# EasyEDA Pro project WEN-多通道电源模块mmk.epro, schematic Schematic7

## Sheets
1 REF多通道: Board Name: WEN-多通道电源模块; Create Date: 2025-05-08; Page Name: REF多通道; Project Name: 【电赛模块】2025电赛预制模块mmkk; Schematic Name: Schematic7; Update Date: 2025-05-09; Company: 嘉立创EDA; Page Size: A1; Version: V1.0
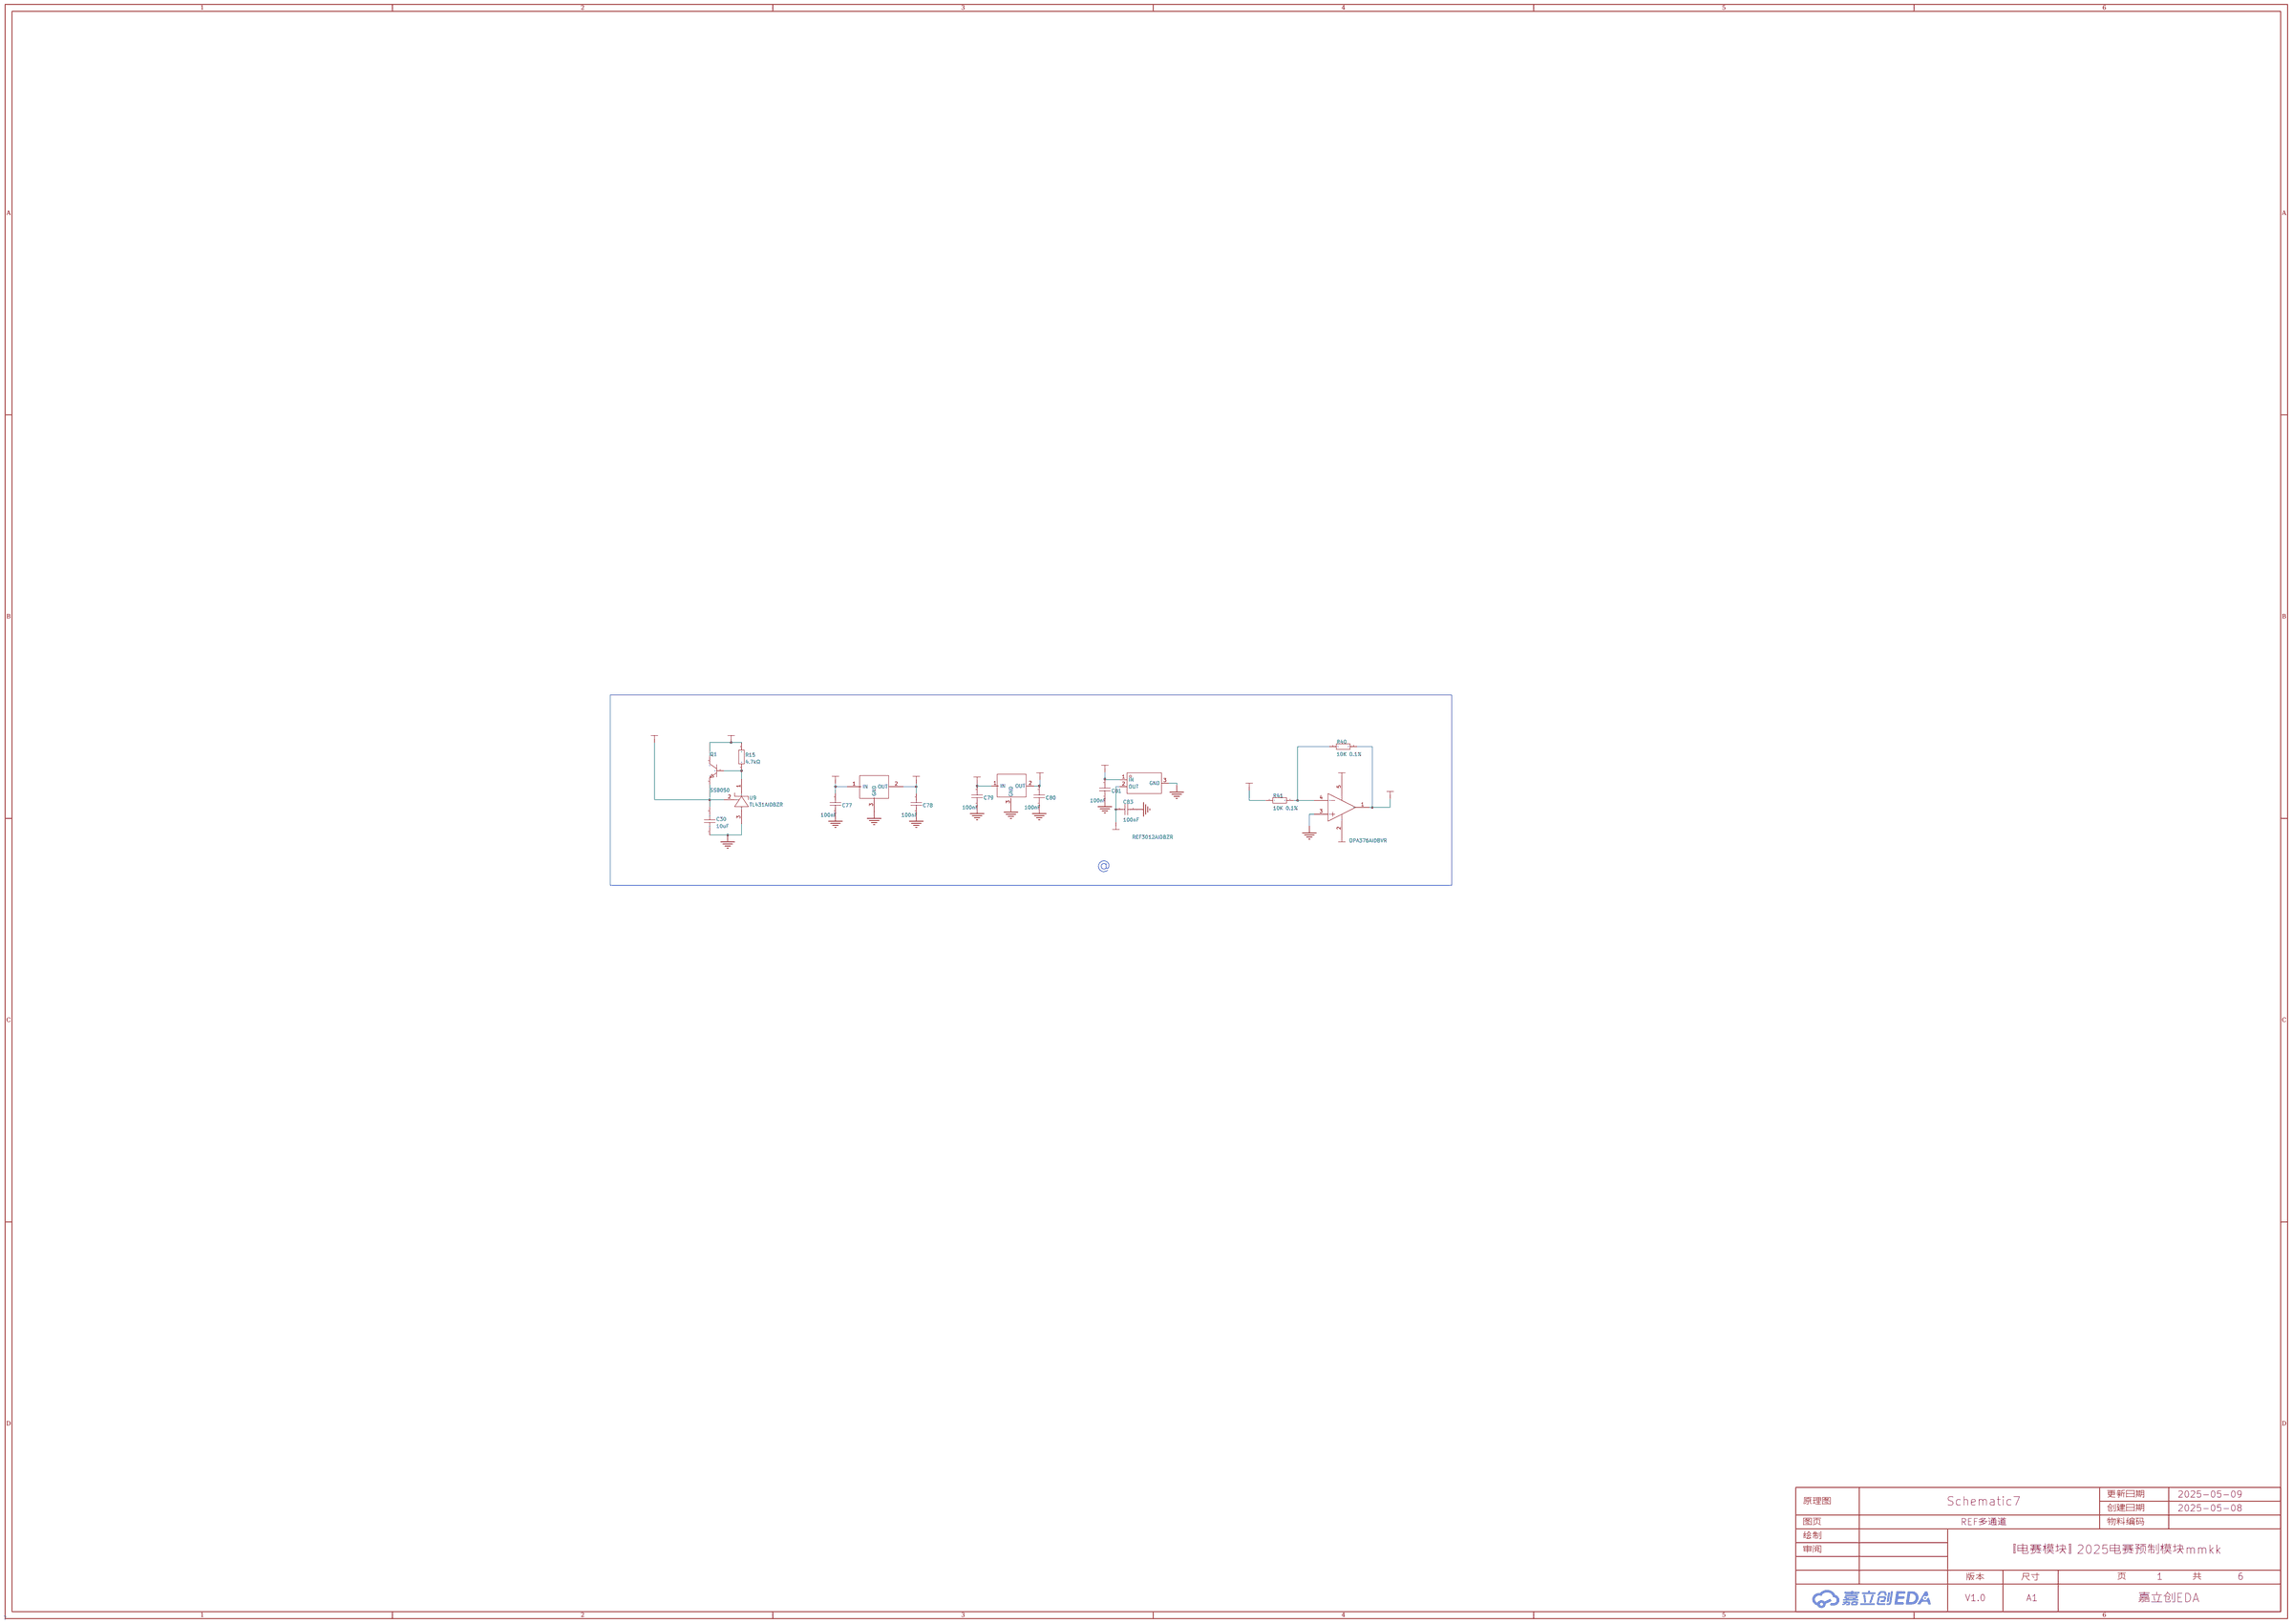
[diagram p0: REF多通道]
2 LDO可调317: Page Name: LDO可调317; Page Size: A4
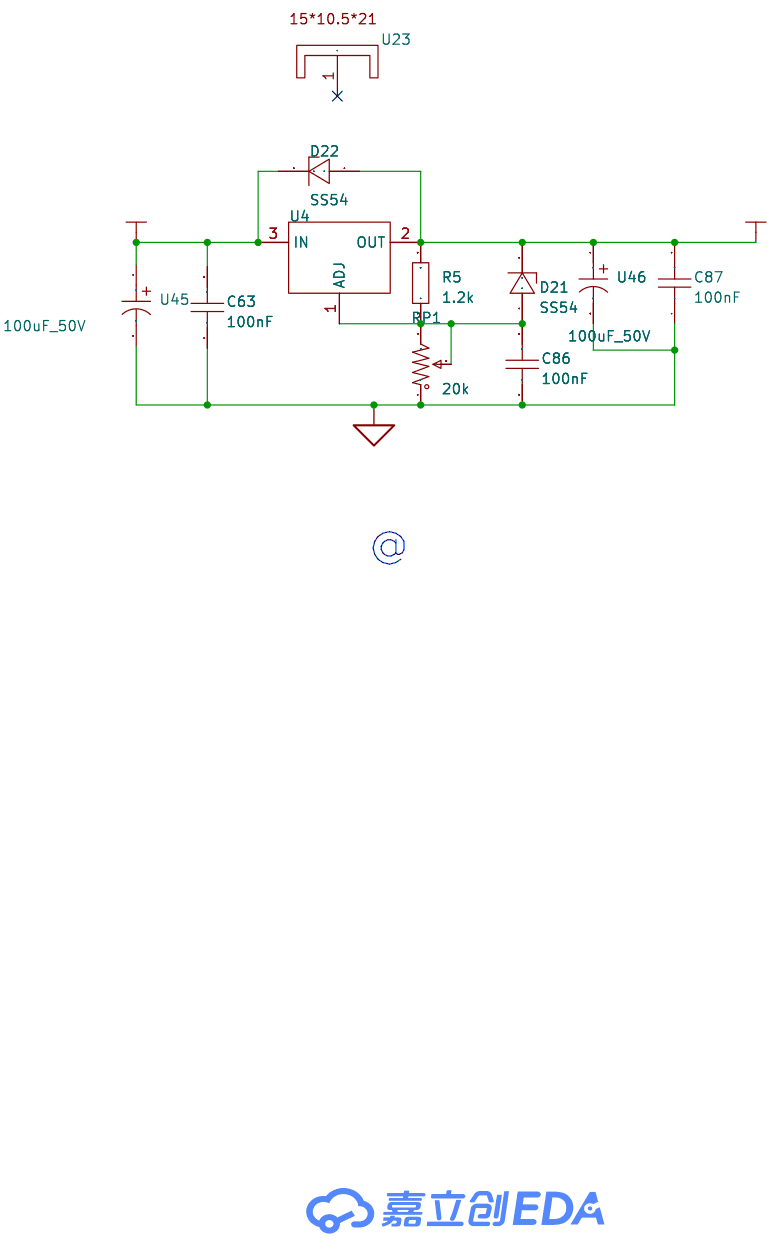
[diagram p1: LDO可调317]
3 DCDC输出: Page Name: DCDC输出; Update Date: 2025-05-10; Page Size: A3
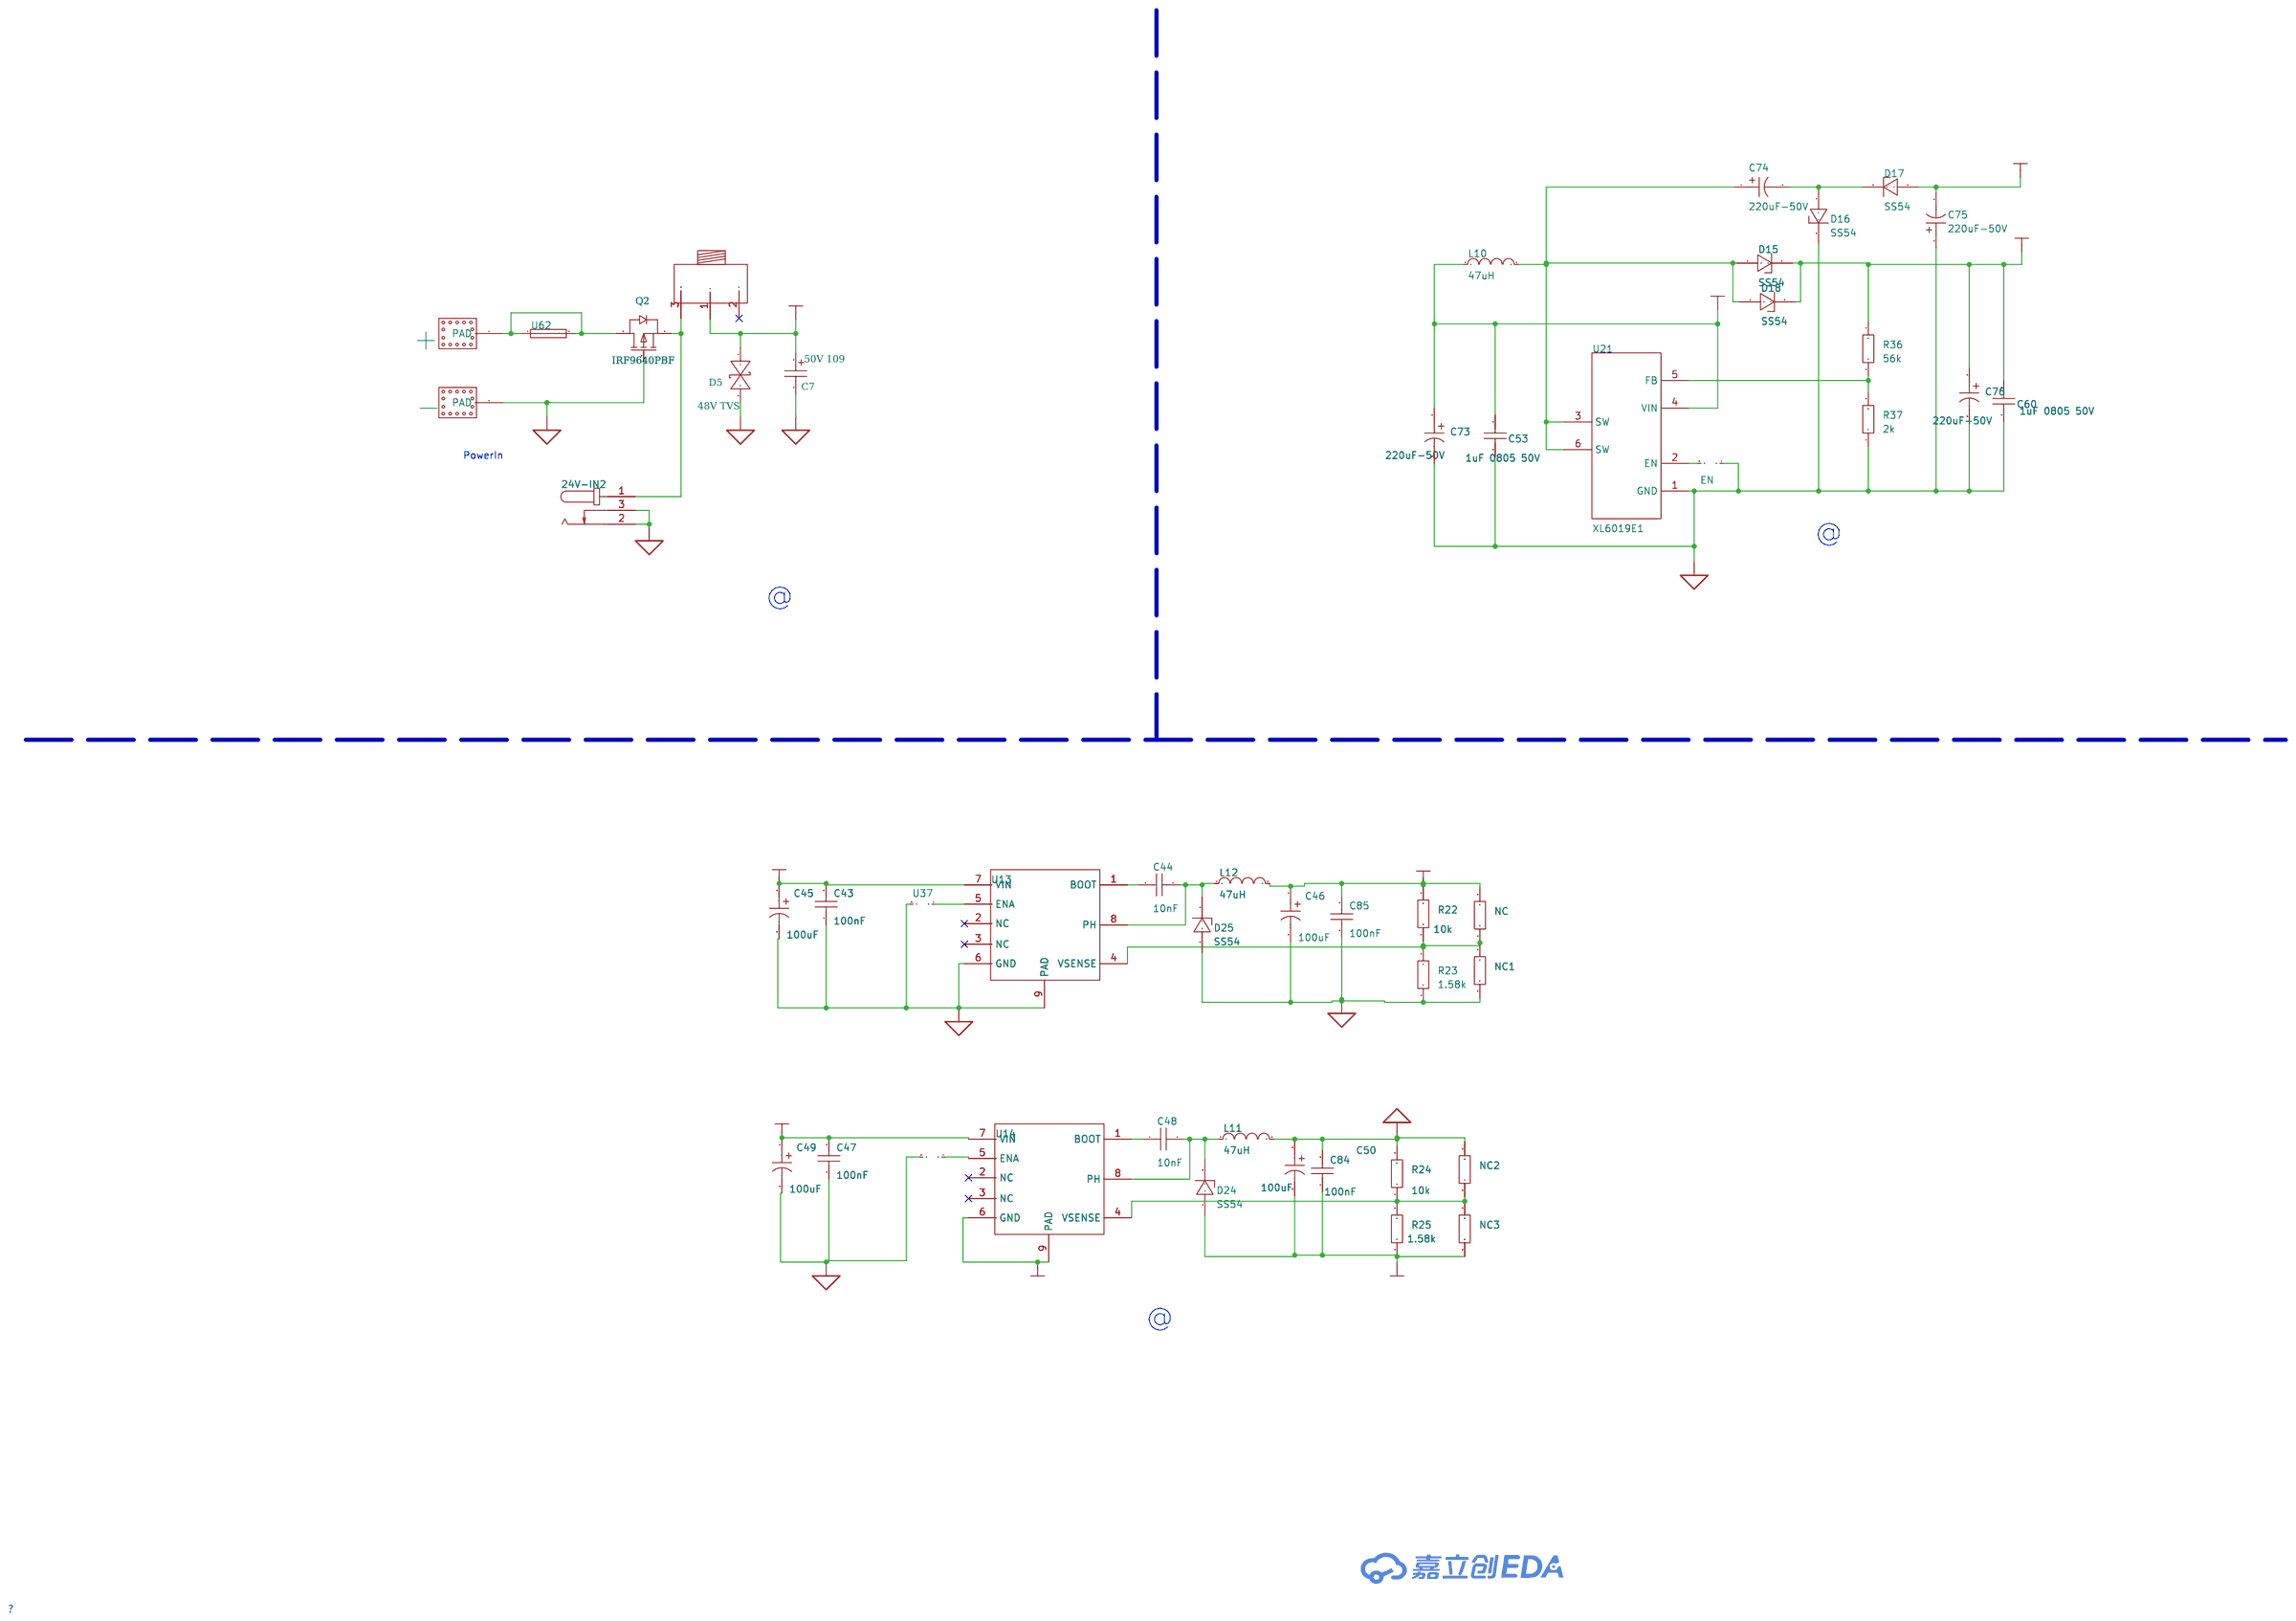
[diagram p2: DCDC输出]
4 LDO输出: Page Name: LDO输出
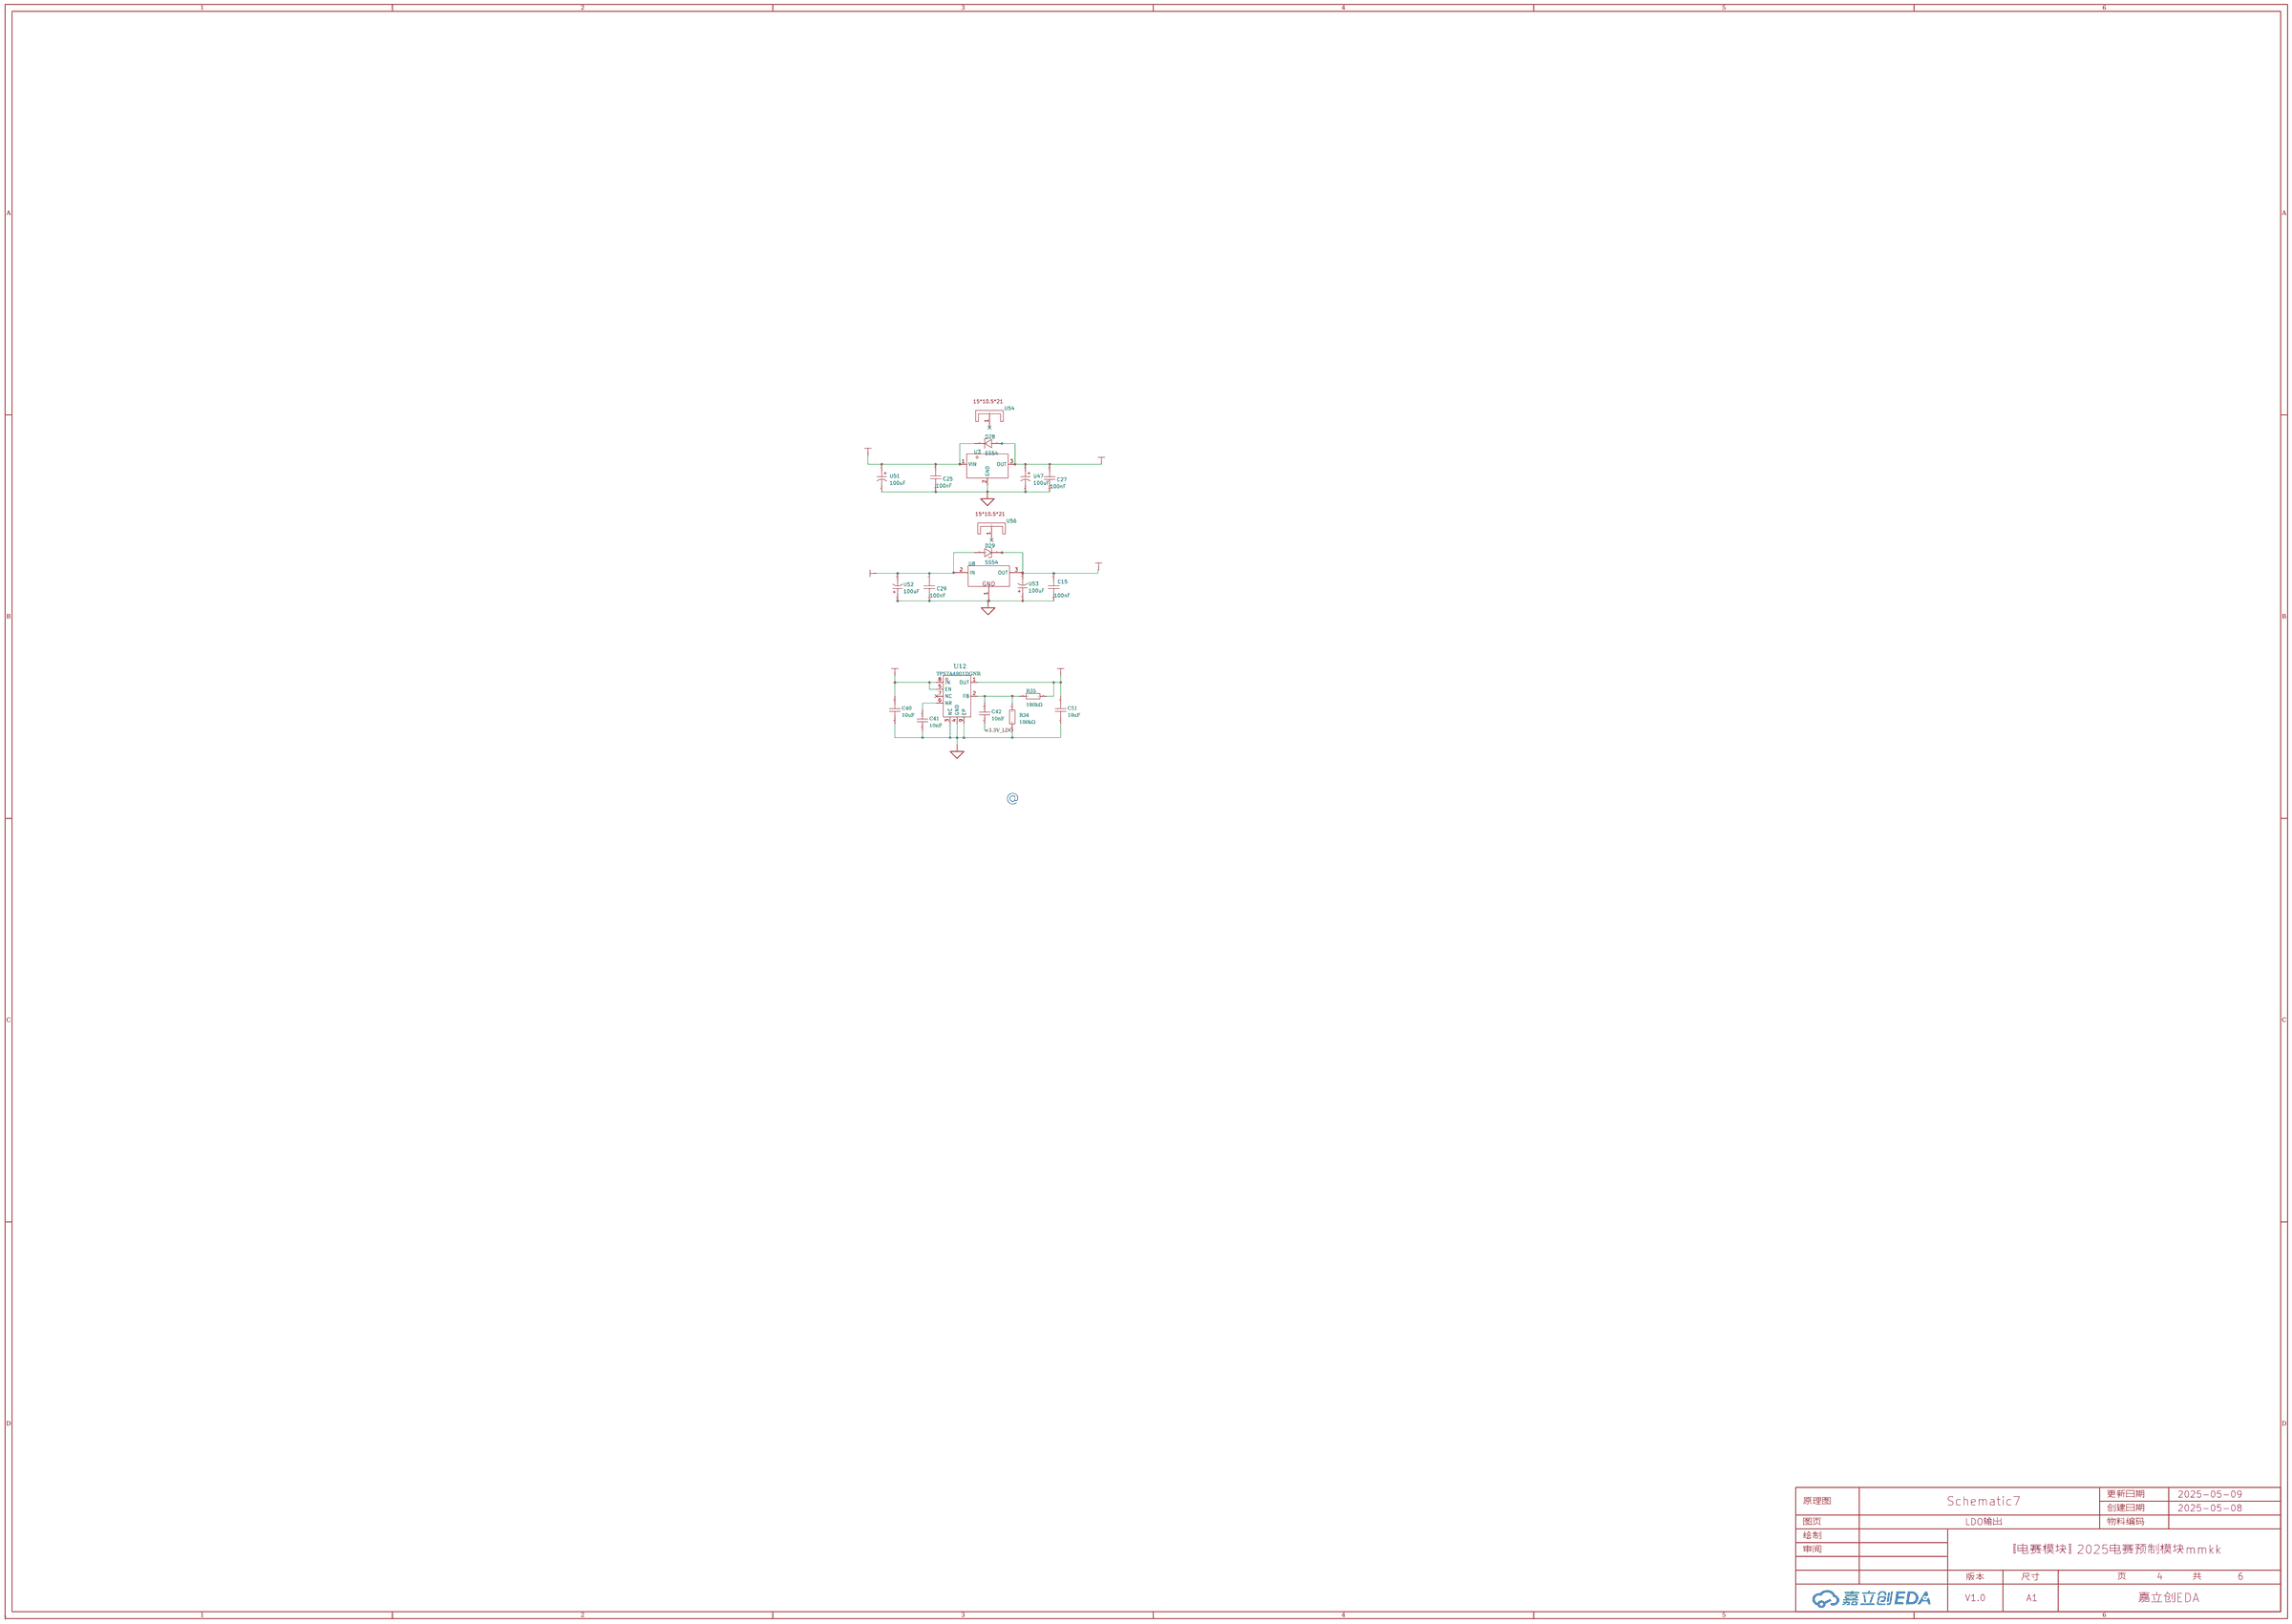
[diagram p3: LDO输出]
5 接口: Create Date: 2025-05-09; Page Name: 接口; Update Date: 2025-05-10
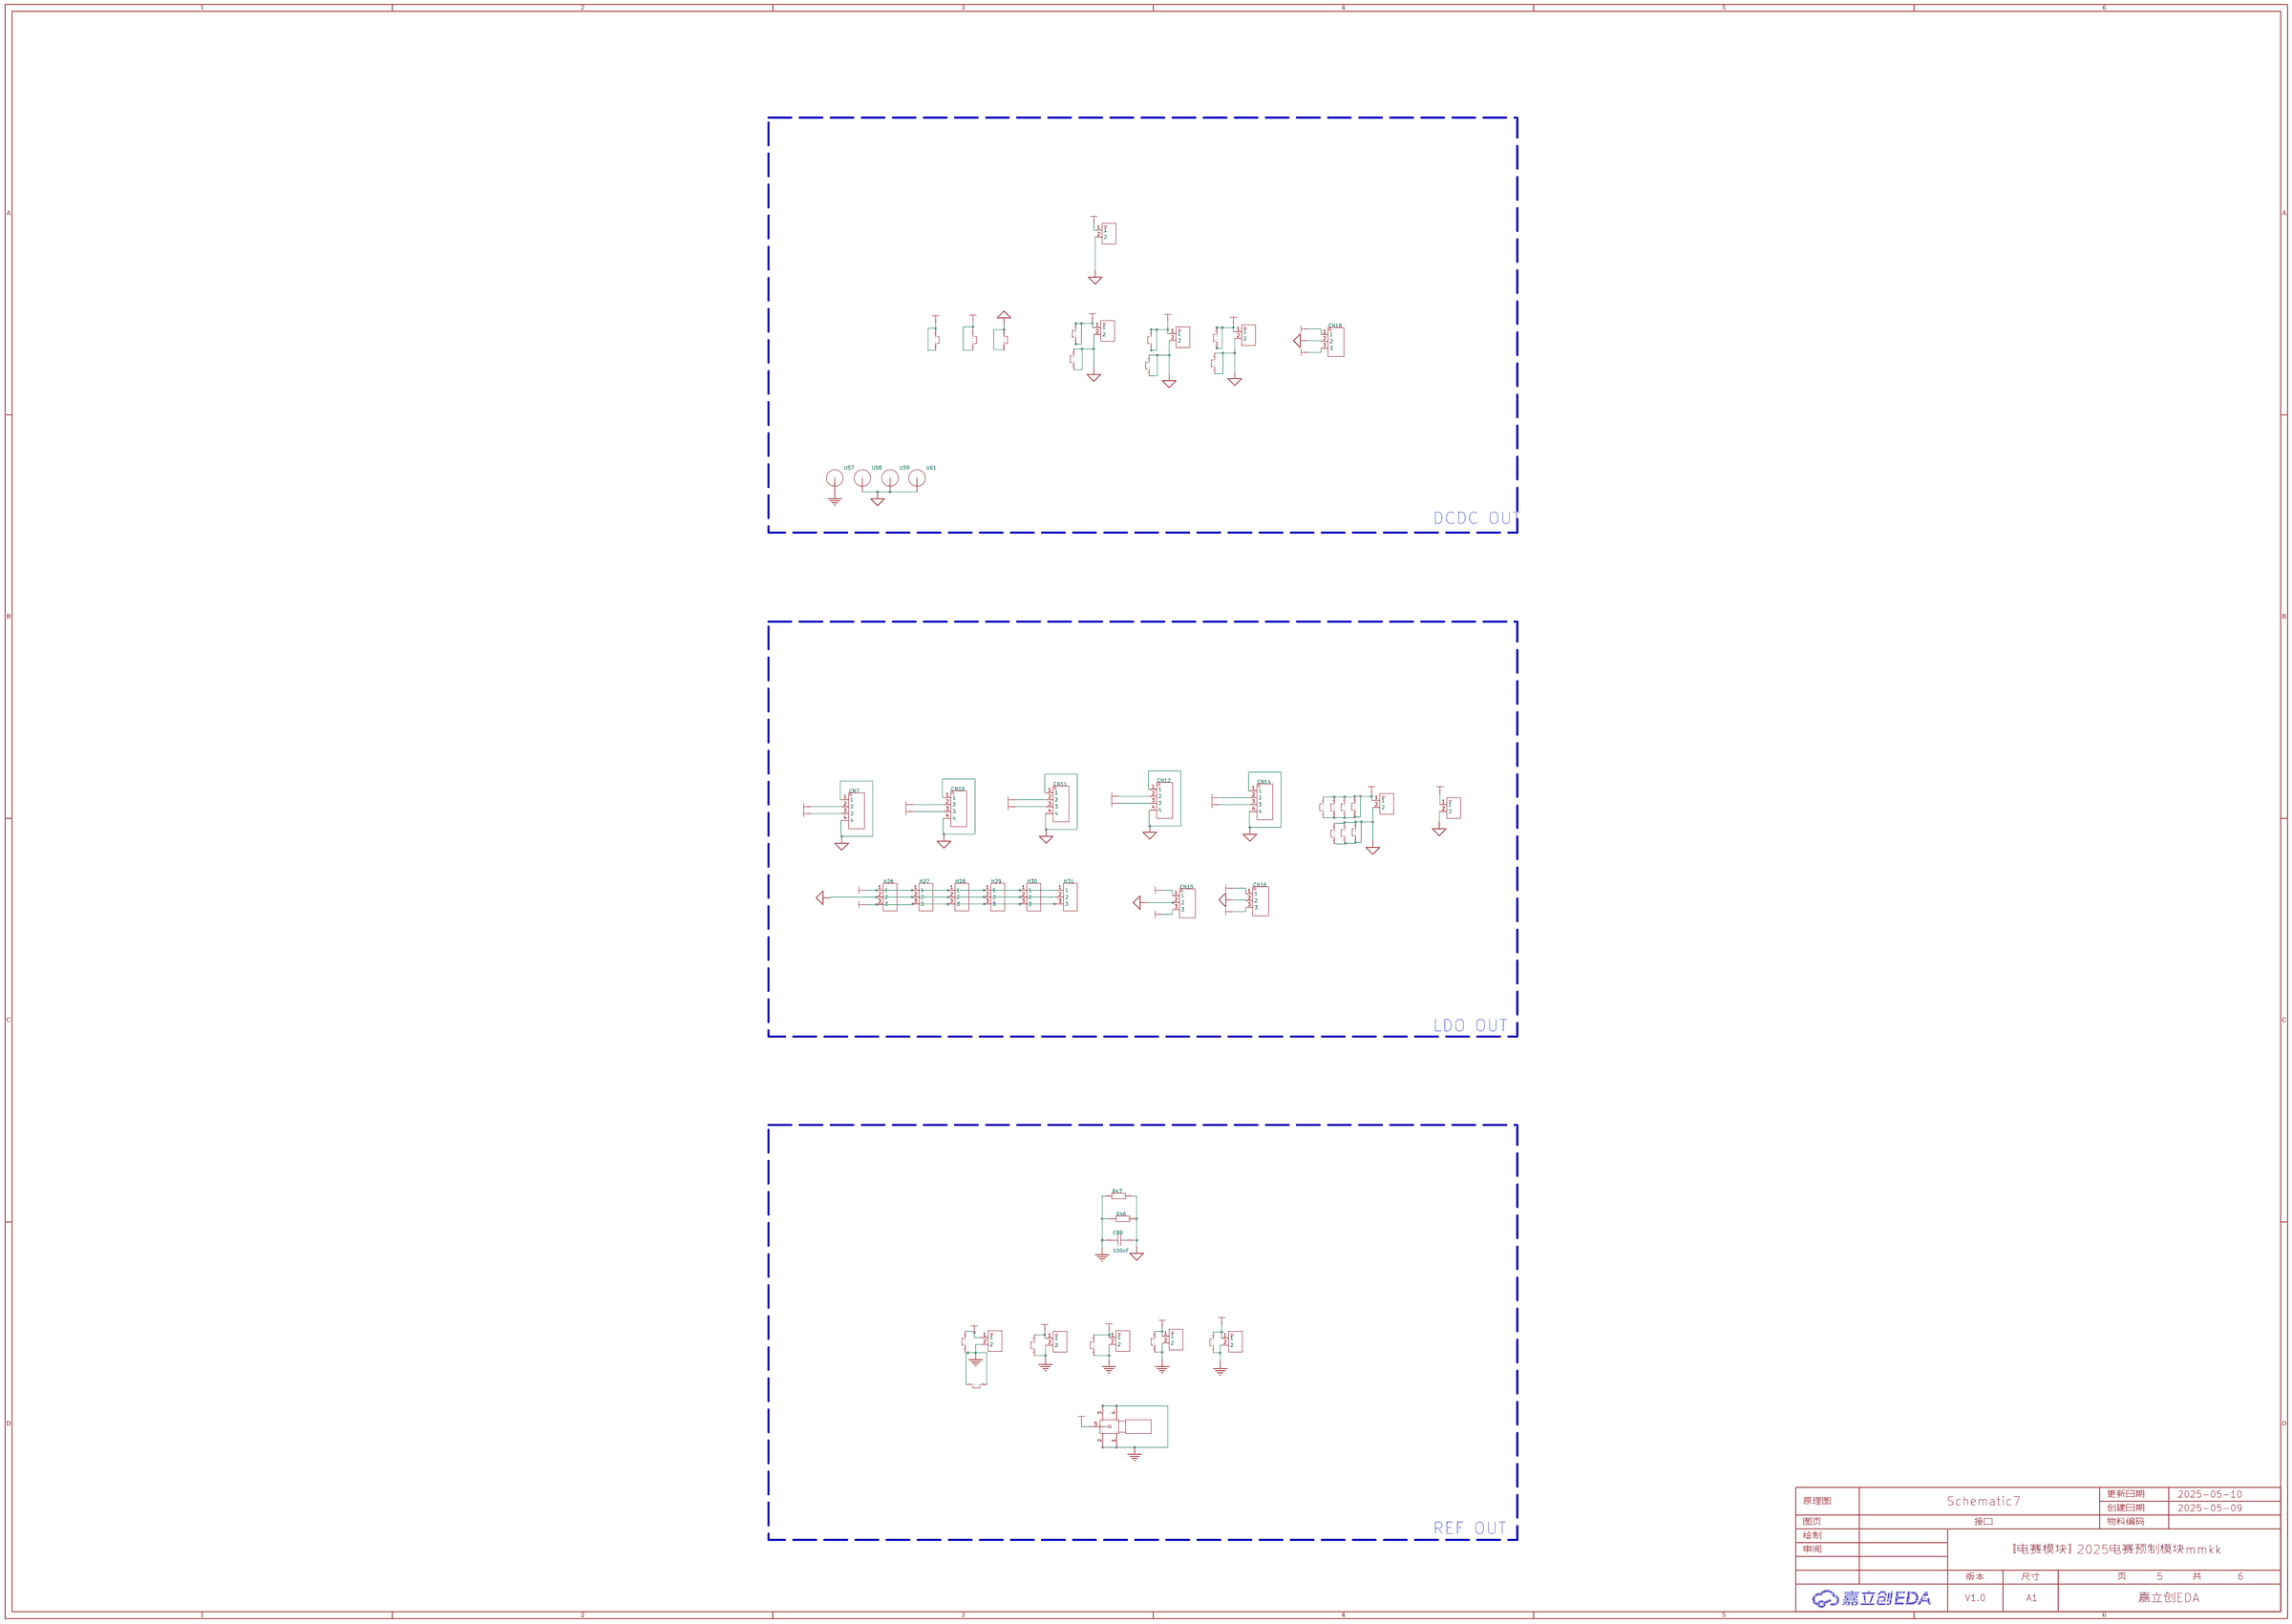
[diagram p4: 接口]
6 指示灯: Create Date: 2025-05-09; Page Name: 指示灯
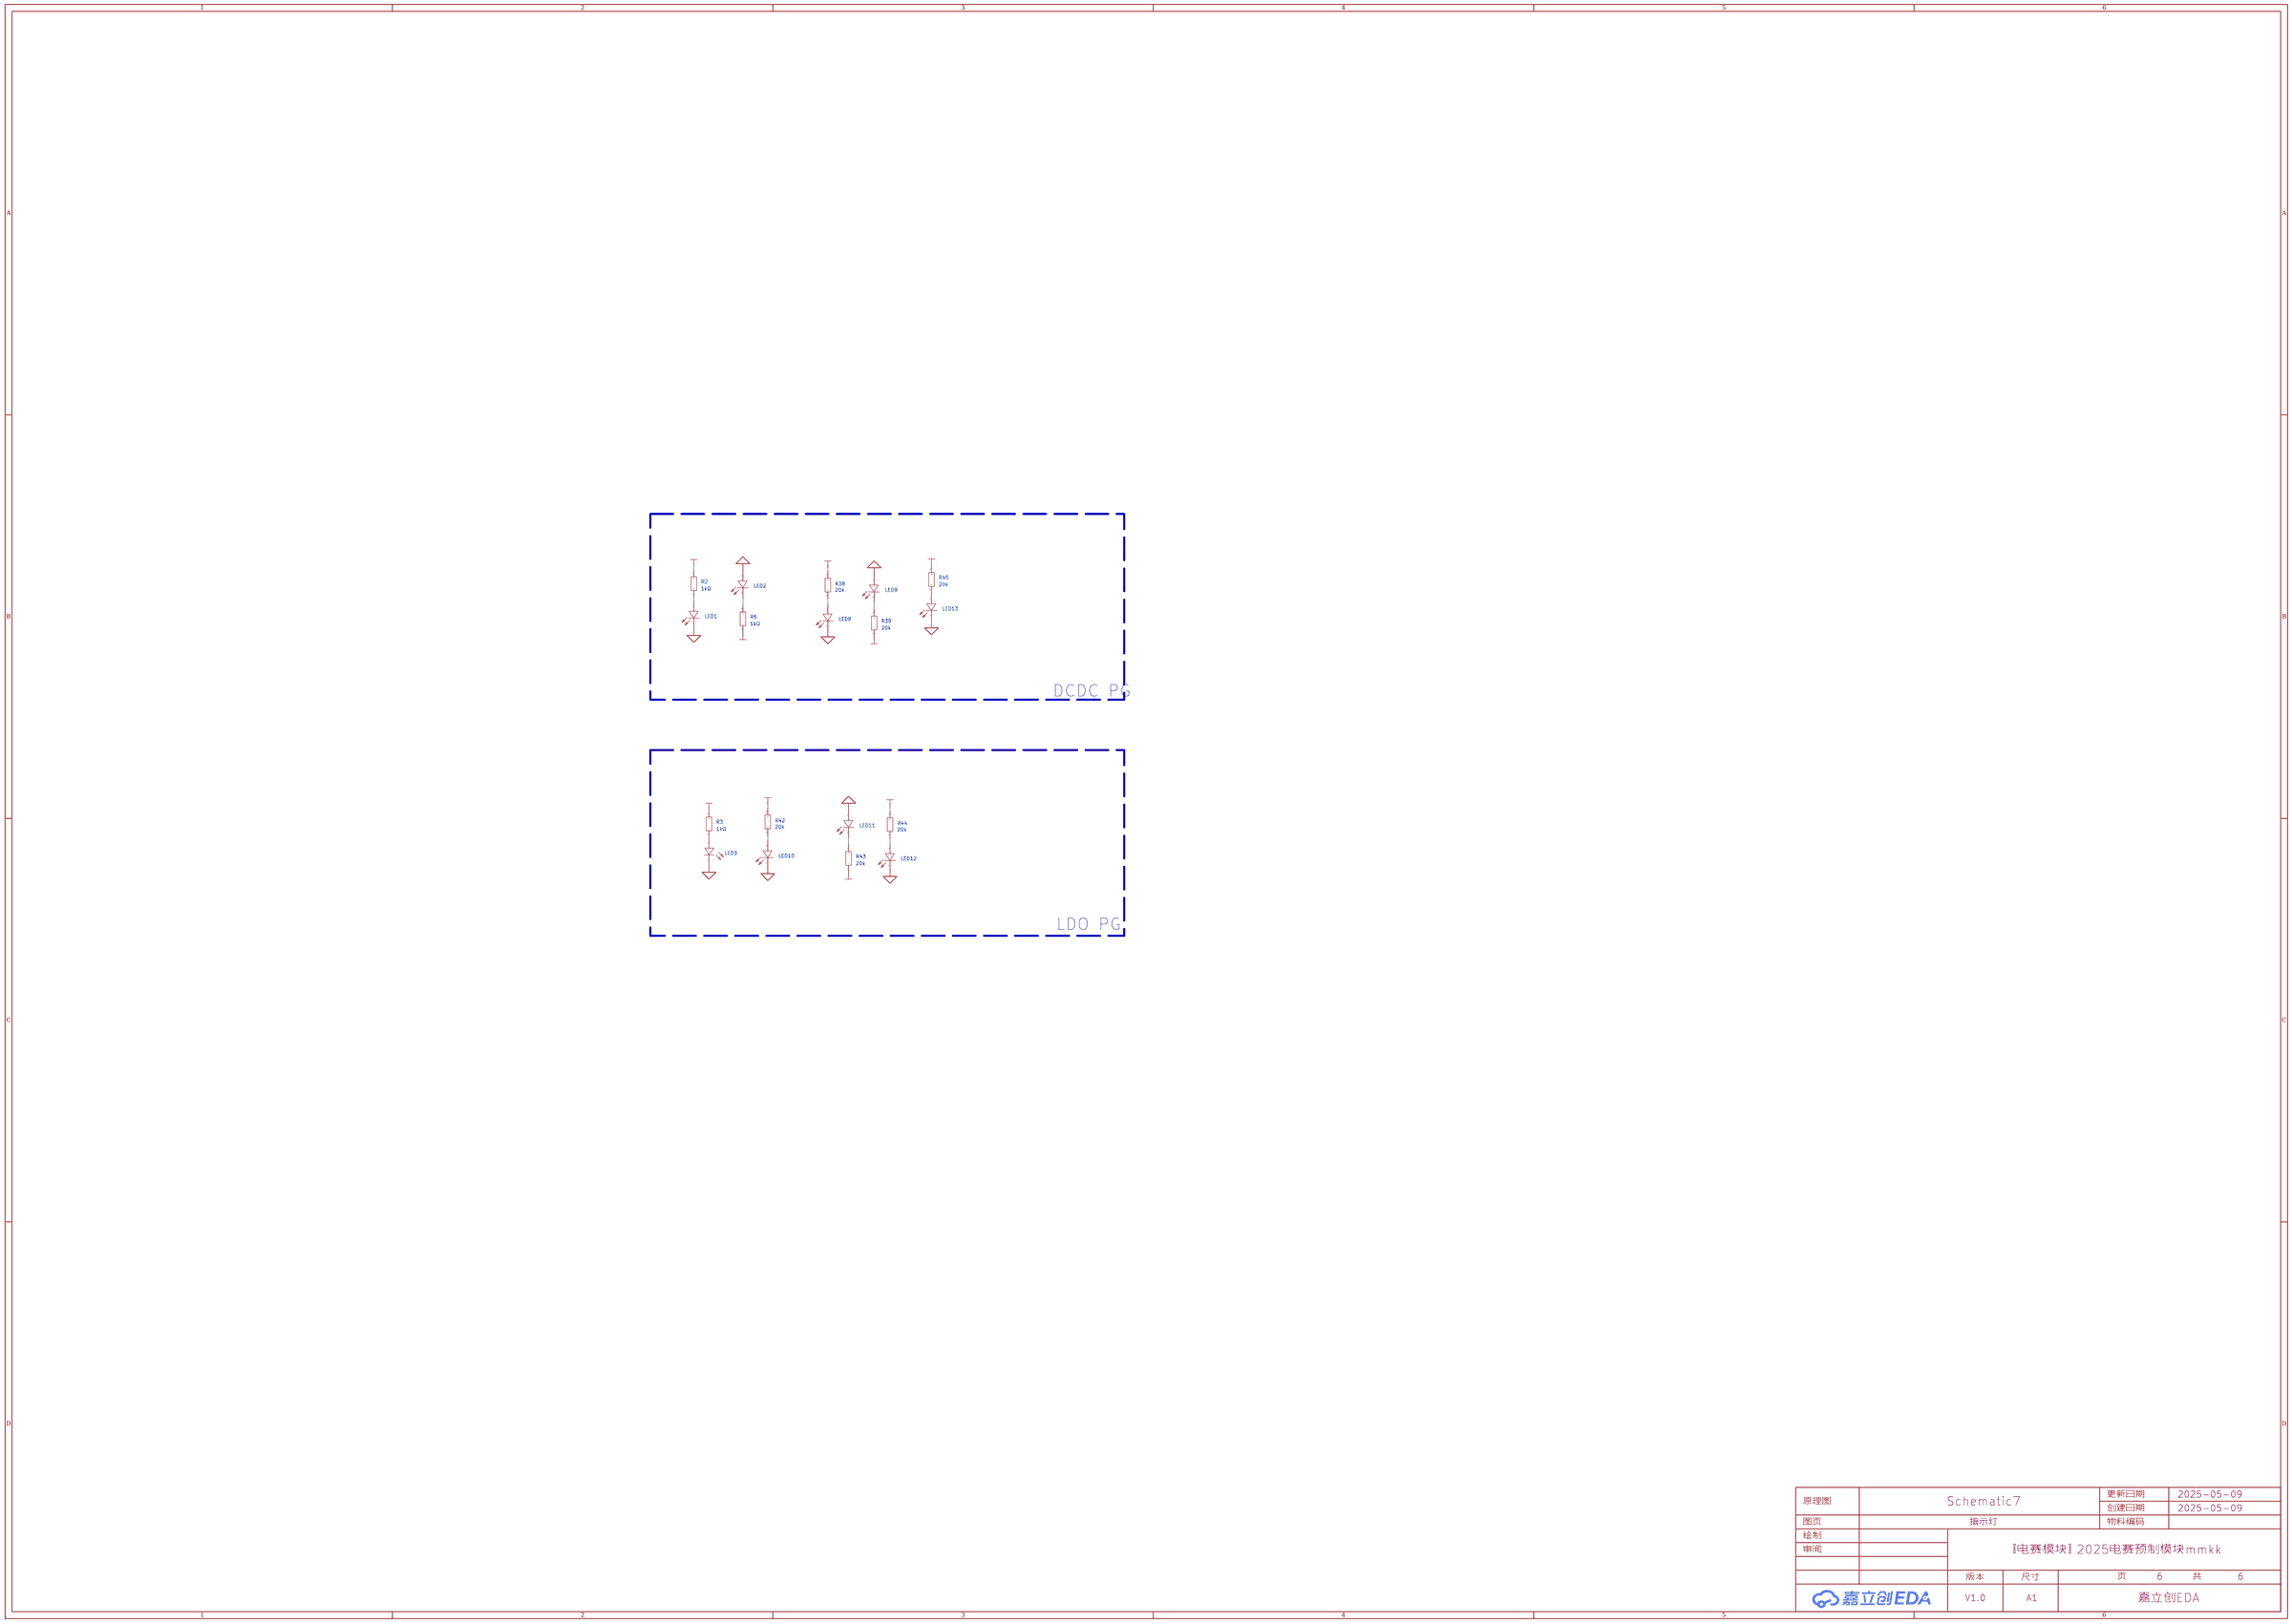
[diagram p5: 指示灯]

## Parts
sheet DCDC输出
24V-IN2  DC-005-20A  [DC-IN-TH_DC-005-20A]
+  -  [外界焊盘R双面-M]
-  -  [外界焊盘R双面-M]
C7  50V 109  [63V10000UF]  (no BOM)
C43  100nF  [C0805]
C44  10nF  [C0805]
C45  100uF  [CAP-SMD_BD6.3-L6.6-W6.6-LS7.6-FD-1]
C46  100uF  [CAP-SMD_BD6.3-L6.6-W6.6-LS7.6-FD-1]
C47  100nF  [C0805]
C48  10nF  [C0805]
C49  100uF  [CAP-SMD_BD6.3-L6.6-W6.6-LS7.6-FD-1]
C50  100uF  [CAP-SMD_BD6.3-L6.6-W6.6-LS7.6-FD-1]
C53  1uF 0805 50V  [C0805]
C60  1uF 0805 50V  [C0805]
C73  220uF-50V  [CAP-SMD_BD8.0-L8.3-W8.3-LS9.1-FD]
C74  220uF-50V  [CAP-SMD_BD8.0-L8.3-W8.3-LS9.1-FD]
C75  220uF-50V  [CAP-SMD_BD8.0-L8.3-W8.3-LS9.1-FD]
C76  220uF-50V  [CAP-SMD_BD8.0-L8.3-W8.3-LS9.1-FD]
C84  100nF  [C0805]
C85  100nF  [C0805]
D5  48V TVS  [DO-214AA_L4.4-W3.6-LS5.3-BI]
D15  SS54  [SMA_L4.3-W2.6-LS5.0-FD]
D16  SS54  [SMA_L4.3-W2.6-LS5.0-FD]
D17  SS54  [SMA_L4.3-W2.6-LS5.0-FD]
D18  SS54  [SMA_L4.3-W2.6-LS5.0-FD]
D24  SS54  [SMA_L4.3-W2.6-LS5.0-FD]
D25  SS54  [SMA_L4.3-W2.6-LS5.0-FD]
L10  47uH  [IND-SMD_L10.8-W10.0_SLO1040H]
L11  47uH  [IND-SMD_L10.8-W10.0_SLO1040H]
L12  47uH  [IND-SMD_L10.8-W10.0_SLO1040H]
NC  10k  [R0805]
NC1  10k  [R0805]
NC2  10k  [R0805]
NC3  10k  [R0805]
Q2  IRF9640PBF  [TO-220-3_L10.0-W4.5-P2.54-L]
R22  10k  [R0805]
R23  1.58k  [R0805]
R24  10k  [R0805]
R25  1.58k  [R0805]
R36  56k  [R0805]
R37  2k  [R0805]
SW3  -  [钮子开关]
U13  TPS5430DDAR  [ESOP-8_L4.9-W3.9-P1.27-LS6.0-TL-EP]
U14  TPS5430DDAR  [ESOP-8_L4.9-W3.9-P1.27-LS6.0-TL-EP]
U21  XL6019E1  [TO-263-5_L10.2-W9.9-P1.70-LS14.4-TL]
U22  EN  [短接调试焊盘]
U37  -  [短接调试焊盘]
U38  -  [短接调试焊盘]
U62  BSMD0805-050-12V  [F0805]  (no BOM)
sheet LDO可调317
C63  100nF  [C0805]
C86  100nF  [C0805]
C87  100nF  [C0805]
D21  SS54  [SMA_L4.3-W2.6-LS5.0-FD]
D22  SS54  [SMA_L4.3-W2.6-LS5.0-FD]
R5  1.2k  [R0805]
RP1  20k  [RES-ADJ-TH_3P-L9.5-W4.85-P2.50-BL-BS]
U4  LM317  [TO-220-3_L10.0-W4.5-P2.54-L]
U23  -  [散热片25*15*10]
U45  100uF_50V  [CAP-SMD_BD6.3-L6.6-W6.6-LS7.2-FD]
U46  100uF_50V  [CAP-SMD_BD6.3-L6.6-W6.6-LS7.2-FD]
sheet LDO输出
C15  100nF  [C0805]
C25  100nF  [C0805]
C27  100nF  [C0805]
C29  100nF  [C0805]
C40  10uF  [C0805]
C41  10nF  [C0805]
C42  10nF  [C0805]
C51  10uF  [C0805]
D28  SS54  [SMA_L4.3-W2.6-LS5.0-FD]
D29  SS54  [SMA_L4.3-W2.6-LS5.0-FD]
R34  100kΩ  [R0805]
R35  180kΩ  [R0805]
U3  LM7805CT  [TO-220-3_L10.0-W4.5-P2.54-L]
U8  LM7905CT/NOPB  [TO-220-3_L10.0-W4.5-P2.54-L]
U12  TPS7A4901DGNR  [MSOP-8_L3.0-W3.0-P0.65-LS5.0-BL-EP]
U47  100uF  [CAP-SMD_BD6.3-L6.6-W6.6-LS7.2-FD]
U51  100uF  [CAP-SMD_BD6.3-L6.6-W6.6-LS7.2-FD]
U52  100uF  [CAP-SMD_BD6.3-L6.6-W6.6-LS7.2-FD]
U53  100uF  [CAP-SMD_BD6.3-L6.6-W6.6-LS7.2-FD]
U54  -  [散热片25*15*10]
U56  -  [散热片25*15*10]
sheet REF多通道
C30  10uF  [C0805]
C77  100nF  [C0805]
C78  100nF  [C0805]
C79  100nF  [C0805]
C80  100nF  [C0805]
C81  100nF  [C0805]
C83  100nF  [C0805]
Q1  SS8050  [SOT-23-3_L2.9-W1.3-P1.90-LS2.4-BR]
R15  4.7kΩ  [R0805]
R40  10K 0.1%  [R0805]
R41  10K 0.1%  [R0805]
U9  TL431AIDBZR  [SOT-23-3_L2.9-W1.6-P1.90-LS2.8-BR]
U25  -  [SOT-23-3_L2.9-W1.6-P1.90-LS2.8-BR]
U26  -  [SOT-23-3_L3.0-W1.7-P0.95-LS2.9-BR]
U27  REF3012AIDBZR  [SOT-23-3_L2.9-W1.3-P1.90-LS2.4-BR]
U28  OPA376AIDBVR  [SOT-23-5_L3.0-W1.7-P0.95-LS2.8-BR]
sheet 指示灯
LED1  NCD0805R1  [LED0603-RD_RED]
LED2  NCD0805R1  [LED0603-RD_RED]
LED3  -  [LED0603-RD_RED]
LED8  NCD0805R1  [LED0603-RD_RED]
LED9  NCD0805R1  [LED0603-RD_RED]
LED10  NCD0805R1  [LED0603-RD_RED]
LED11  NCD0805R1  [LED0603-RD_RED]
LED12  NCD0805R1  [LED0603-RD_RED]
LED13  NCD0805R1  [LED0603-RD_RED]
R2  1kΩ  [R0805]
R3  1kΩ  [R0805]
R6  1kΩ  [R0805]
R38  20k  [R0805]
R39  20k  [R0805]
R42  20k  [R0805]
R43  20k  [R0805]
R44  20k  [R0805]
R45  20k  [R0805]
sheet 接口
C88  100nF  [C0603]
CN7  WJ15EDGVC-3.81-4P  [CONN-TH_4P-P3.81_WJ2EDGVC-3.81-4P]
CN10  WJ15EDGVC-3.81-4P  [CONN-TH_4P-P3.81_WJ2EDGVC-3.81-4P]
CN11  WJ15EDGVC-3.81-4P  [CONN-TH_4P-P3.81_WJ2EDGVC-3.81-4P]
CN12  WJ15EDGVC-3.81-4P  [CONN-TH_4P-P3.81_WJ2EDGVC-3.81-4P]
CN14  WJ15EDGVC-3.81-4P  [CONN-TH_4P-P3.81_WJ2EDGVC-3.81-4P]
CN15  WJ15EDGVC-3.81-3P  [CONN-TH_3P-P3.81_WJ15EDGVC-3.81-3P]
CN16  WJ15EDGVC-3.81-3P  [CONN-TH_3P-P3.81_WJ15EDGVC-3.81-3P]
CN18  WJ15EDGVC-3.81-3P  [CONN-TH_3P-P3.81_WJ15EDGVC-3.81-3P]
H1  PZ254V-11-02P  [HDR-TH_2P-P2.54-V-M]
H2  PZ254V-11-02P  [HDR-TH_2P-P2.54-V-M]
H3  PZ254V-11-02P  [HDR-TH_2P-P2.54-V-M]
H4  PZ254V-11-02P  [HDR-TH_2P-P2.54-V-M]
H5  PZ254V-11-02P  [HDR-TH_2P-P2.54-V-M]
H7  PZ254V-11-02P  [HDR-TH_2P-P2.54-V-M]
H8  PZ254V-11-02P  [HDR-TH_2P-P2.54-V-M]
H9  PZ254V-11-02P  [HDR-TH_2P-P2.54-V-M]
H10  PZ254V-11-02P  [HDR-TH_2P-P2.54-V-M]
H15  PZ254V-11-02P  [HDR-TH_2P-P2.54-V-M]
H16  PZ254V-11-02P  [HDR-TH_2P-P2.54-V-M]
H19  PZ254V-11-02P  [HDR-TH_2P-P2.54-V-M]
H20  PZ254V-11-02P  [HDR-TH_2P-P2.54-V-M]
H21  PZ254V-11-02P  [HDR-TH_2P-P2.54-V-M]
H22  PZ254V-11-02P  [HDR-TH_2P-P2.54-V-M]
H23  PZ254V-11-02P  [HDR-TH_2P-P2.54-V-M]
H24  PZ254V-11-02P  [HDR-TH_2P-P2.54-V-M]
H25  PZ254V-11-02P  [HDR-TH_2P-P2.54-V-M]
H26  PZ254V-11-03P  [HDR-TH_3P-P2.54-V-M]
H27  PZ254V-11-03P  [HDR-TH_3P-P2.54-V-M]
H28  PZ254V-11-03P  [HDR-TH_3P-P2.54-V-M]
H29  PZ254V-11-03P  [HDR-TH_3P-P2.54-V-M]
H30  PZ254V-11-03P  [HDR-TH_3P-P2.54-V-M]
H31  PZ254V-11-03P  [HDR-TH_3P-P2.54-V-M]
H32  PZ254V-11-02P  [HDR-TH_2P-P2.54-V-M]
H33  PZ254V-11-02P  [HDR-TH_2P-P2.54-V-M]
H34  PZ254V-11-02P  [HDR-TH_2P-P2.54-V-M]
H35  PZ254V-11-02P  [HDR-TH_2P-P2.54-V-M]
R46  -  [R0603]
R47  -  [R0603]
RF1  BWSMA-KE-Z001  [SMA-TH_BWSMA-KE-Z001]
U24  -  [【电赛】直插拔端子-2P-3.81mm]
U29  -  [【电赛】直插拔端子-2P-3.81mm]
U30  -  [【电赛】直插拔端子-2P-3.81mm]
U31  -  [【电赛】直插拔端子-2P-3.81mm]
U32  -  [【电赛】直插拔端子-2P-3.81mm]
U34  -  [【电赛】直插拔端子-2P-3.81mm]
U36  -  [【电赛】直插拔端子-2P-3.81mm]
U41  -  [【电赛】直插拔端子-2P-3.81mm]
U43  -  [【电赛】直插拔端子-2P-3.81mm]
U44  -  [【电赛】直插拔端子-2P-3.81mm]
U57  -  [My_M3螺丝孔]
U58  -  [My_M3螺丝孔]
U59  -  [My_M3螺丝孔]
U61  -  [My_M3螺丝孔]
U64  -  [【电赛】直插拔端子-2P-3.81mm]

## Library data of the parts
24V-IN2 = DC-005-20A_C136744: 连接器类型:DC电源插座;安装方式:弯插;触点内径:2mm;触点外径:6.4mm;额定电流:500mA;额定电压:30V;工作温度范围:-25℃~+80℃;; LCSC Part Name: DC电源插座 内径:2mm 外径:6.4mm; Supplier Part: C136744; Manufacturer: 韩国韩荣; Supplier Footprint: 插件; JLCPCB Part Class: 扩展库; Datasheet: https://atta.szlcsc.com/upload/public/pdf/source/20210810/D1FE451D887B1804F0660F580C4AD849.pdf; Supplier: LCSC; Connector Type: DC电源插座; Mounting Style: 弯插; Inside Contact Diameter: 2mm; Outside Contact Diameter: 6.4mm; Current Rating (Max): 500mA; Voltage Rating (Max): 30V; Operating Temperature Range: -25℃~+80℃
+ = 外接焊盘R双面-M
- = 外接焊盘R双面-M: Check: true
C7 = 10000uF 50V: Nichicon FW Gold Aluminum Electrolytic Capacitor
C43 C47 C84 C85 = 0805B104K500NT: 容值:100nF;精度:±10%;额定电压:50V;材质(温度系数):X7R;; LCSC Part Name: 100nF ±10% 50V; Supplier Part: C38141; Manufacturer: FH(风华); Supplier Footprint: 0805; JLCPCB Part Class: Extended Part; Datasheet: https://atta.szlcsc.com/upload/public/pdf/source/20170923/C38141_1506149447419988747.pdf; Supplier: LCSC; Tolerance: ±10%; Voltage Rated: 50V; Temperature Coefficient: X7R
C44 C48 = 0805B103K500NT_C52278: 容值:10nF;精度:±10%;额定电压:50V;材质(温度系数):X7R;; LCSC Part Name: 10nF ±10% 50V; Supplier Part: C52278; Manufacturer: FH(风华); Manufacturer Part: 0805B103K500NT; Supplier Footprint: 0805; JLCPCB Part Class: Extended Part; Datasheet: https://atta.szlcsc.com/upload/public/pdf/source/20170923/C52278_1506149485247988826.pdf; Supplier: LCSC; Tolerance: ±10%; Voltage Rated: 50V; Temperature Coefficient: X7R
C45 C46 C49 C50 = RVE100UF35V67RV0072: 容值:100uF;额定电压:35V;纹波电流:-;等效串联电阻:-;; LCSC Part Name: 100uF 35V; Supplier Part: C2836437; Manufacturer: KNSCHA(科尼盛); Supplier Footprint: SMD,D6.3xL7.7mm; JLCPCB Part Class: Extended Part; Datasheet: https://atta.szlcsc.com/upload/public/pdf/source/20220719/B52EB46F8A1558448ED03D8B4CB3C24F.pdf; Supplier: LCSC; Rated Voltage: 35V
C53 C60 C77-C81 C83 = CL21B105KBFNNNE: 容值:1uF;精度:±10%;额定电压:50V;材质(温度系数):X7R;; LCSC Part Name: 1uF ±10% 50V; Supplier Part: C28323; Manufacturer: SAMSUNG(三星); Supplier Footprint: 0805; JLCPCB Part Class: 基础库; Datasheet: https://atta.szlcsc.com/upload/public/pdf/source/20160218/1457707763339.pdf; Supplier: LCSC; Tolerance: ±10%; Voltage Rated: 50V; Temperature Coefficient: X7R
C73-C76 = VP1H221M0810: 容值:220uF;精度:±20%;额定电压:50V;纹波电流:150mA;等效串联电阻:-;; LCSC Part Name: 220uF ±20% 50V; Supplier Part: C4054388; Manufacturer: HONOR(荣誉); JLCPCB Part Class: Extended Part; Datasheet: https://atta.szlcsc.com/upload/public/pdf/source/20220810/5ED31D27C84133E597BCBE81D274CAE7.pdf; Supplier: LCSC; Tolerance: ±20%; Rated Voltage: 50V; Ripple Current: 150mA; φD: 8mm; L: 10.2mm; Operating Temperature: -55℃~+105℃
D5 = SMBJ48CA-TR: 反向截止电压(Vrwm):48V;最大钳位电压:77.4V;峰值脉冲电流(Ipp)@10/1000us:8.1A;峰值脉冲功率(Ppp)@10/1000us:600W;击穿电压:53.3V;; Supplier: LCSC; Supplier Part: C672136; Manufacturer: ST(意法半导体); JLCPCB Part Class: 扩展库; LCSC Part Name: 双向TVS 48V截止; Supplier Footprint: DO-214AA; Datasheet: https://atta.szlcsc.com/upload/public/pdf/source/20211229/08FD311EEB6251CB78BA453C6CB18B67.pdf; Reverse Stand-Off Voltage (Vrwm): 48V; Maximum Clamping Voltage: 77.4V; Peak Pulse Current (Ipp)@10/1000us: 8.1A; Peak Pulse Power Dissipation (Ppp)@10/1000us: 600W; Breakdown Voltage: 53.3V; Reverse Leakage Current (Ir): 200nA; Type: TVS
D15-D18 D21 D22 D24 D25 D28 D29 = SS54_C7420369: 二极管配置:独立式;正向压降(Vf):550mV@5.0A;直流反向耐压(Vr):40V;整流电流:5A;; LCSC Part Name: 电压:40V 电流:5A; Supplier Part: C7420369; Manufacturer: 宏迦橙; Supplier Footprint: SMA(DO-214AC); JLCPCB Part Class: 扩展库; Datasheet: https://atta.szlcsc.com/upload/public/pdf/source/20230828/254C3882F8647358AD9F60DD73611B5E.pdf; Supplier: LCSC; Diode Configuration: 独立式; Forward Voltage (Vf@If): 550mV@5.0A; Reverse Voltage (Vr): 40V; Rectified Current: 5A; Reverse Leakage Current (Ir): 50uA@40V
L10-L12 = SLO1040H470MTT: 电感值:47uH;精度:±20%;额定电流:3A;; LCSC Part Name: 47uH ±20%; Supplier Part: C182153; Manufacturer: Sunltech(韩国顺磁); Supplier Footprint: SMD; JLCPCB Part Class: 扩展库; Datasheet: https://atta.szlcsc.com/upload/public/pdf/source/20201009/C207854_ACA4210DD273ACBB198904FC5A3A8806.pdf; Supplier: LCSC; Tolerance: ±20%; Rated Current: 3A; DC Resistance (DCR): 145mΩ
NC NC1-NC3 R22 R24 = 0805W8F1002T5E_C17414: 电阻类型:厚膜电阻;阻值:10kΩ;精度:±1%;功率:125mW;; LCSC Part Name: 10kΩ ±1% 125mW; Supplier Part: C17414; Manufacturer: UNI-ROYAL(厚声); Manufacturer Part: 0805W8F1002T5E; Supplier Footprint: 0805; JLCPCB Part Class: Basic Part; Datasheet: https://atta.szlcsc.com/upload/public/pdf/source/20200306/C422600_1E6D84923E4A46A82E41ADD87F860B5C.pdf; Supplier: LCSC; Type: 厚膜电阻; Tolerance: ±1%; Power(Watts): 125mW; Temperature Coefficient: ±100ppm/℃; Overload Voltage (Max): 150V; Operating Temperature Range: -55℃~+155℃
Q2 = IRF9640PBF: 类型:P沟道;漏源电压(Vdss):200V;连续漏极电流(Id):11A;功率(Pd):125W;导通电阻(RDS(on)@Vgs,Id):500mΩ@10V,6.6A;阈值电压(Vgs(th)@Id):4V@250uA;; LCSC Part Name: P沟道 耐压:200V 电流:11A; Supplier Part: C2628; Manufacturer: VISHAY(威世); Supplier Footprint: TO-220AB; JLCPCB Part Class: 扩展库; Datasheet: https://atta.szlcsc.com/upload/public/pdf/source/20160723/1469258971783.pdf; Supplier: LCSC; Type: P沟道; Drain Source Voltage (Vdss): 200V; Continuous Drain Current (Id): 11A; Power Dissipation (Pd): 125W; Drain Source On Resistance (RDS(on)@Vgs,Id): 500mΩ@10V,6.6A; Gate Threshold Voltage (Vgs(th)@Id): 4V@250uA; Total Gate Charge (Qg@Vgs): 44nC@10V; Input Capacitance (Ciss@Vds): 1.2nF@25V; Operating Temperature: -55℃~+150℃@(Tj)
R23 R25 = 0805W8F3241T5E: 电阻类型:厚膜电阻;阻值:3.24kΩ;精度:±1%;功率:125mW;; LCSC Part Name: 3.24kΩ ±1% 125mW; Supplier Part: C17609; Manufacturer: UNI-ROYAL(厚声); Supplier Footprint: 0805; JLCPCB Part Class: Extended Part; Datasheet: https://atta.szlcsc.com/upload/public/pdf/source/20200306/C422600_1E6D84923E4A46A82E41ADD87F860B5C.pdf; Supplier: LCSC; Type: 厚膜电阻; Tolerance: ±1%; Power(Watts): 125mW; Temperature Coefficient: ±100ppm/℃; Overload Voltage (Max): 150V; Operating Temperature Range: -55℃~+155℃
R2 R6 R36-R39 R42-R45 = 0805W8F1001T5E: 电阻类型:厚膜电阻;阻值:1kΩ;精度:±1%;功率:125mW;; LCSC Part Name: 1kΩ ±1% 125mW; Supplier Part: C17513; Manufacturer: UNI-ROYAL(厚声); Supplier Footprint: 0805; JLCPCB Part Class: Basic Part; Datasheet: https://atta.szlcsc.com/upload/public/pdf/source/20200306/C422600_1E6D84923E4A46A82E41ADD87F860B5C.pdf; Supplier: LCSC; Type: 厚膜电阻; Tolerance: ±1%; Power(Watts): 125mW; Temperature Coefficient: ±100ppm/℃; Overload Voltage (Max): 150V; Operating Temperature Range: -55℃~+155℃
SW3 = 钮子开关
U13 U14 = TPS5430DDAR: 功能类型:降压型;输出类型:可调;输入电压:5.5V~36V;输出电压:1.221V~32.04V;输出电流(最大值):3A;; LCSC Part Name: 降压 3A 36V; Supplier Part: C9864; Manufacturer: TI(德州仪器); Supplier Footprint: SOIC-8-EP; JLCPCB Part Class: 基础库; Datasheet: https://www.ti.com/cn/lit/gpn/tps5430; Supplier: LCSC; Function: 降压型; Output Type: 可调; Input Voltage: 5.5V~36V; Output Voltage: 1.221V~32.04V; Output Current (Max): 3A; Switching Frequency: 500kHz; Operating Temperature: -40℃~+125℃@(TJ); Synchronous Rectification: 否; Number of Outputs: 1; Topology: 降压式; Switch tube (built-in/external): 内置
U21 = XL6019E1: 功能类型:升降压型;输出类型:可调;工作电压:5V~40V;输出电压:-;输出电流:5A;; LCSC Part Name: 180KHz 60V 5A开关电流升压/升降压型DC-DC转换器; Supplier Part: C73018; Manufacturer: XLSEMI(芯龙); Supplier Footprint: TO-263-5; JLCPCB Part Class: 扩展库; Datasheet: https://atta.szlcsc.com/upload/public/pdf/source/20230915/0F37A40A07D65557F92F701F29EBE038.pdf; Supplier: LCSC; Function: 升降压型; Output Type: 可调; Input Voltage: 5V~40V; Output Current: 5A; Switching Frequency: 180kHz; Operating Temperature: -40℃~+125℃; Synchronous Rectification: 是; Number of Outputs: 1; Topology: 反相式; Quiescent Current (Iq): 2.5mA; Switch tube (built-in/external): 内置
U22 U37 U38 = 短接焊锡焊盘
U62 = BSMD0805-050-12V: 最大电压:12V;最大电流:40A;保持电流:500mA;跳闸电流:1A;; LCSC Part Name: 12V 0.5A 0805自恢复; Supplier Part: C2977522; Manufacturer: BHFUSE(佰宏); Supplier Footprint: 0805; JLCPCB Part Class: 扩展库; Datasheet: https://atta.szlcsc.com/upload/public/pdf/source/20230512/7A46D6CD923C15CBB98FD769C08EDD80.pdf; Supplier: LCSC; Operating Voltage (Max): 12V; Current Rating (Max): 40A; Hold Current: 500mA; Trip Current: 1A; Power Dissipation: 500mW; Resistance - Initial (Ri) (Min): 100mΩ; Resistance - Post Trip (R1) (Max): 850mΩ; Maximum Time to Trip: 100ms
C63 = CAP_0805: Supplier Footprint: 0805
C86 C87 = FCC0805B104K500DT: 容值:100nF;精度:±10%;额定电压:50V;温度系数:X7R;; LCSC Part Name: 100nF ±10% 50V; Supplier Part: C5137467; Manufacturer: FOJAN(富捷); Supplier Footprint: 0805; JLCPCB Part Class: 扩展库; Datasheet: https://atta.szlcsc.com/upload/public/pdf/source/20220818/0EB3B7FB2F5648AC16609637FBA7DABE.pdf; Supplier: LCSC; Tolerance: ±10%; Voltage Rating: 50V; Temperature Coefficient: X7R
R5 = MFR-12FTE52-240R: 电阻类型:金属膜电阻;阻值:240Ω;精度:±1%;功率:166.667mW;温度系数:±50ppm/℃;; LCSC Part Name: 金属膜电阻 240Ω ±1% 166.667mW; Supplier Part: C172898; Manufacturer: YAGEO(国巨); Supplier Footprint: 轴向引线; JLCPCB Part Class: Extended Part; Datasheet: https://atta.szlcsc.com/upload/public/pdf/source/20180511/C172898_717798422DEDE32076C253B2DAFFD6AF.pdf; Supplier: LCSC; Type: 金属膜电阻; Tolerance: ±1%; Power(Watts): 166.667mW; Temperature Coefficient: ±50ppm/℃
RP1 = 3296W-1-502: 阻值:5kΩ;精度:±10%;; LCSC Part Name: 5kΩ ±10%; Supplier Part: C118907; Manufacturer: BOCHEN(博晨); Supplier Footprint: 插件; JLCPCB Part Class: Extended Part; Datasheet: https://atta.szlcsc.com/upload/public/pdf/source/20171114/C118907_15106326547951117397.pdf; Supplier: LCSC; Tolerance: ±10%
U4 = LM317: 输出类型:可调;输出极性:正;最大输入电压:40V;输出电压:1.2V~37V;输出电流:1.5A;; LCSC Part Name: ADJ 输入40V 输出1.2V~37V 1.5A; Supplier Part: C22147; Manufacturer: CJ(江苏长电/长晶); Supplier Footprint: TO-220; JLCPCB Part Class: Extended Part; Datasheet: https://atta.szlcsc.com/upload/public/pdf/source/20170403/1491183225245.pdf; Supplier: LCSC; Output Type: 可调; Output Polarity: 正; Number of Outputs: 1; Maximum Input Voltage: 40V; Output Voltage: 1.2V~37V; Dropout Voltage: 5V@(500mA); Output Current: 1.5A
U23 U54 U56 = 散热片25*15*10
U45-U47 U51-U53 = VP1H101M0607: 容值:100uF;精度:±20%;额定电压:50V;纹波电流:80mA;等效串联电阻(ESR):-;; LCSC Part Name: 100uF ±20% 50V; Supplier Part: C4054386; Manufacturer: HONOR(荣誉); Supplier Footprint: SMD,D6.3xL7.7mm; JLCPCB Part Class: Extended Part; Datasheet: https://atta.szlcsc.com/upload/public/pdf/source/20220818/58094135E0815D904C1FF86D7C76B70D.pdf; Supplier: LCSC; Tolerance: ±20%; Voltage Rating: 50V; Ripple Current: 80mA; Diameter: 6.3mm; Height - Seated (Max): 7.7mm; Operating Temperature: -55℃~+105℃
C15 C25 C27 C29 = DCS104M26Y5UF6FJ5A0: 容值:100nF;精度:±20%;额定电压:50V;温度系数:Y5U;; LCSC Part Name: 100nF ±20% 50V 半导体瓷介电容器; Supplier Part: C2896063; Manufacturer: SHM(南方宏明); Supplier Footprint: 插件,P=5mm; JLCPCB Part Class: 扩展库; Datasheet: https://atta.szlcsc.com/upload/public/pdf/source/20210926/5108EA716B26000394C19365B75013E5.pdf; Supplier: LCSC; Tolerance: ±20%; Voltage Rated: 50V; Lead Spacing: 5mm; Temperature Coefficient: Y5U
C40 C51 = CL10A106MA8NRNC: 容值:10uF;精度:±20%;额定电压:25V;材质(温度系数):X5R;; LCSC Part Name: 10uF ±20% 25V; Supplier Part: C96446; Manufacturer: SAMSUNG(三星); Supplier Footprint: 0603; JLCPCB Part Class: 基础库; Datasheet: https://atta.szlcsc.com/upload/public/pdf/source/20160218/1457707763339.pdf; Supplier: LCSC; Tolerance: ±20%; Voltage Rated: 25V; Temperature Coefficient: X5R
C41 C42 = CL10B103KB8NNNC: 容值:10nF;精度:±10%;额定电压:50V;材质(温度系数):X7R;; LCSC Part Name: 10nF ±10% 50V; Supplier Part: C1589; Manufacturer: SAMSUNG(三星); Supplier Footprint: 0603; JLCPCB Part Class: 扩展库; Datasheet: https://atta.szlcsc.com/upload/public/pdf/source/20160218/1457707763339.pdf; Supplier: LCSC; Tolerance: ±10%; Voltage Rated: 50V; Temperature Coefficient: X7R
R34 = 0603WAF1003T5E: 电阻类型:厚膜电阻;阻值:100kΩ;精度:±1%;功率:100mW;最大工作电压:75V;温度系数:±100ppm/℃;; LCSC Part Name: 100kΩ ±1% 100mW 厚膜电阻; Supplier Part: C25803; Manufacturer: UNI-ROYAL(厚声); Supplier Footprint: 0603; JLCPCB Part Class: 基础库; Datasheet: https://atta.szlcsc.com/upload/public/pdf/source/20200306/C422600_1E6D84923E4A46A82E41ADD87F860B5C.pdf; Supplier: LCSC; Type: 厚膜电阻; Tolerance: ±1%; Power(Watts): 100mW; Overload Voltage (Max): 75V; Temperature Coefficient: ±100ppm/℃; Operating Temperature Range: -55℃~+155℃
R35 = 0603WAF1803T5E: 电阻类型:厚膜电阻;阻值:180kΩ;精度:±1%;功率:100mW;最大工作电压:75V;温度系数:±100ppm/℃;; LCSC Part Name: 180kΩ ±1% 100mW 厚膜电阻; Supplier Part: C22827; Manufacturer: UNI-ROYAL(厚声); Supplier Footprint: 0603; JLCPCB Part Class: 扩展库; Datasheet: https://atta.szlcsc.com/upload/public/pdf/source/20200306/C422600_1E6D84923E4A46A82E41ADD87F860B5C.pdf; Supplier: LCSC; Type: 厚膜电阻; Tolerance: ±1%; Power(Watts): 100mW; Overload Voltage (Max): 75V; Temperature Coefficient: ±100ppm/℃; Operating Temperature Range: -55℃~+155℃
U3 = LM7805CT: 输出类型:-;; LCSC Part Name: 1A 宽输入电压固定电压稳压器; Supplier Part: C725349; Manufacturer: HGSEMI(华冠); Supplier Footprint: TO-220; JLCPCB Part Class: Extended Part; Datasheet: https://atta.szlcsc.com/upload/public/pdf/source/20200820/C725349_485A99725F48272E129B3B4FC6C4D51A.pdf; Supplier: LCSC
U8 = LM7905CT/NOPB: LM79 Microprocessor System Hardware Monitor; Supplier Part: C352863; Manufacturer: TI(德州仪器); Supplier Footprint: TO-220-3; JLCPCB Part Class: Extended Part; Datasheet: 2022-08-13/803287S/06ce324fe59a4f0aacd9fb428fc622b5/lm7905.pdf; Supplier: LCSC
U12 = TPS7A4901DGNR: 输出类型:可调;最大输入电压:35V;输出电压:1.194V~33V;最大输出电流:150mA;电源纹波抑制比(PSRR):78dB@(1kHz);输出极性:正极;; Supplier: LCSC; Manufacturer: TI(德州仪器); Supplier Part: C16430; JLCPCB Part Class: 扩展库; LCSC Part Name: ADJ 输入35V 输出1.176V~33V 150mA; Supplier Footprint: HVSSOP-8; Datasheet: https://www.ti.com/cn/lit/gpn/tps7a49; Output Type: 可调; Maximum Input Voltage: 35V; Output Voltage: 1.194V~33V; MAX Output Current: 150mA; Power Supply Rejection Ratio (PSRR): 78dB@(1kHz); Dropout Voltage: 450mV@(1A); standby current: 100uA; Operating Temperature: -40℃~+125℃; Output Polarity: 正极; Number of Outputs: 1
C30 = HGC1206R5106K500NSPJ: 容值:10uF;精度:±10%;额定电压:50V;温度系数:X5R;; LCSC Part Name: 10uF ±10% 50V; Supplier Part: C7432781; Manufacturer: Chinocera(华瓷); Supplier Footprint: 1206; JLCPCB Part Class: 扩展库; Datasheet: https://atta.szlcsc.com/upload/public/pdf/source/20240320/FAC3FEC40A78BC5CCCE96C232A94D860.pdf; Supplier: LCSC; Tolerance: ±10%; Voltage Rating: 50V; Temperature Coefficient: X5R
Q1 = SS8050_C7420370: 晶体管类型:NPN;集电极电流(Ic):1.5A;集射极击穿电压(Vceo):25V;耗散功率(Pd):300mW;直流电流增益(hFE):120@100mA,1.0V;; LCSC Part Name: H档 200-350; Supplier Part: C7420370; Manufacturer: 宏嘉诚; Supplier Footprint: SOT-23; JLCPCB Part Class: 扩展库; Datasheet: https://atta.szlcsc.com/upload/public/pdf/source/20250205/5DB94E86981B5B1A1866D18E379C0D4F.pdf; Supplier: LCSC; type: NPN; Current - Collector(Ic): 1.5A; Collector - Emitter Voltage VCEO: 25V; Pd - Power Dissipation: 300mW; DC Current Gain: 120@100mA,1.0V; Transition frequency(fT): 100MHz; Current - Collector Cutoff: 100nA; Vce Saturation(VCE(sat)): 500mV; Operating Temperature: -55℃~+150℃
R15 = 0805W8F4701T5E: 电阻类型:厚膜电阻;阻值:4.7kΩ;精度:±1%;功率:125mW;最大工作电压:150V;温度系数:±100ppm/℃;; LCSC Part Name: 4.7kΩ ±1% 125mW 厚膜电阻; Supplier Part: C17673; Manufacturer: UNI-ROYAL(厚声); Supplier Footprint: 0805; JLCPCB Part Class: 基础库; Datasheet: https://atta.szlcsc.com/upload/public/pdf/source/20200306/C422600_1E6D84923E4A46A82E41ADD87F860B5C.pdf; Supplier: LCSC; Type: 厚膜电阻; Tolerance: ±1%; Power(Watts): 125mW; Overload Voltage (Max): 150V; Temperature Coefficient: ±100ppm/℃; Operating Temperature Range: -55℃~+155℃
R40 R41 = Res_0603: Supplier Footprint: 0603
U9 = TL431AIDBZR: 输出类型:可调;输入电压:-;输出电压:2.495V~36V;输出电流:100mA;精度:±1%;; Supplier Part: C23892; Manufacturer: TI(德州仪器); Supplier Footprint: SOT-23; JLCPCB Part Class: 扩展库; Datasheet: https://www.ti.com/cn/lit/gpn/tl431; Supplier: LCSC; Output Type: 可调; Output Voltage: 2.495V~36V; Output Current: 100mA; Tolerance: ±1%; Reference Type: 并联; Minimum Cathode Current for Regulation: 700uA; Operating Temperature: -40℃~+85℃@(Ta)
U25 = 2.5V基准源REF3025: 属性	参数值 / 商品目录	电压基准芯片 / 输出类型	固定 / 工作电压	2.55V~5.5V / 输出电压	2.5V / 输出电流	25mA / 精度	±0.2% / 属性	参数值 / 温度系数	75ppm/℃ / 电压基准类型	串联 / 静态电流(Iq)	50uA / 噪声(0.1Hz-10Hz)	28uVp-p / 噪声(10Hz-10kHz)	80uVrms / 工作温度	-40℃~+125℃@(Ta)
U26 = 3.3V基准源REF3033_: 75ppm_-40℃~+125℃
U27 = REF3012AIDBZR: 输出类型:固定;输入电压:1.8V~5.5V;输出电压:1.25V;输出电流:25mA;精度:±0.2%;; Supplier Part: C34674; Manufacturer: TI(德州仪器); Supplier Footprint: SOT-23; JLCPCB Part Class: 扩展库; Datasheet: https://www.ti.com/cn/lit/gpn/ref3020; Supplier: LCSC; Output Type: 固定; Input Voltage: 1.8V~5.5V; Output Voltage: 1.25V; Output Current: 25mA; Tolerance: ±0.2%; Temperature Coefficient: 75ppm/℃; Reference Type: 串联; Supply Current: 50uA; Noise - 10Hz to 10kHz: 42uVrms; Operating Temperature: -40℃~+125℃@(Ta)
U28 = OPA376AIDBVR: 放大器数:单路;增益带宽积(GBP):5.5MHz;输入偏置电流(Ib):0.2pA;压摆率(SR):2V/us;轨到轨:-;; Supplier Part: C42134; Manufacturer: TI(德州仪器); Supplier Footprint: SOT-23-5; JLCPCB Part Class: Extended Part; Datasheet: https://www.ti.com/cn/lit/gpn/opa376; Supplier: LCSC; Number of Circuits: 单路; Gain Bandwidth Product(GBP): 5.5MHz; Current - Input Bias(Ib): 0.2pA; Slew Rate(SR): 2V/us; Output Current: 50mA; Supply Current: 760uA; Operating Temperature: -40℃~+125℃
LED1 LED2 LED8-LED13 = NCD0805R1: 发光颜色:红灯;; LCSC Part Name: 红灯; Supplier Part: C84256; Manufacturer: 国星光电; Supplier Footprint: 0805; JLCPCB Part Class: Basic Part; Datasheet: https://atta.szlcsc.com/upload/public/pdf/source/20200820/C84256_F0A75A43B3EAD75808600A0514C76B99.pdf; Supplier: LCSC; Emitted Color: 红灯
LED3 = LED_TH-R_3mm: Supplier Footprint: 插件; Supplier Part: C99771
R3 = MFR0W4F1001A50: 电阻类型:金属膜电阻;阻值:1kΩ;精度:±1%;功率:250mW;温度系数:±50ppm/℃;; LCSC Part Name: 金属膜电阻 1kΩ ±1% 250mW; Supplier Part: C57435; Manufacturer: UNI-ROYAL(厚声); Supplier Footprint: 轴向引线; JLCPCB Part Class: Extended Part; Datasheet: https://atta.szlcsc.com/upload/public/pdf/source/20170615/1497511028539.pdf; Supplier: LCSC; Type: 金属膜电阻; Tolerance: ±1%; Power(Watts): 250mW; Temperature Coefficient: ±50ppm/℃
C88 = CAP_0603: Supplier Footprint: 0603
CN7 CN10-CN12 CN14 = WJ15EDGVC-3.81-4P: 连接器类型:板端/插座-闭口;固定方式:-;结构:1x4P;间距:3.81mm;颜色:-;安装方式:直针;排数:1;每排PIN数:4;额定电流:8A;额定电压:300V;线规 - AWG:-;线规 - 平方毫米:-;触头材质:黄铜;触头镀层:锡;工作温度范围:-40℃~+105℃;焊接温度(最大值):-;; LCSC Part Name: 1x4P 3.81mm 排数:1 每排P数:4; Supplier Part: C8410; Manufacturer: KANGNEX(康奈克斯电气); Supplier Footprint: 插件,P=3.81mm; JLCPCB Part Class: 扩展库; Datasheet: https://atta.szlcsc.com/upload/public/pdf/source/20191225/C8410_C8794F457058DA07325589F32B6A11CC.pdf; Supplier: LCSC; Connector Type: 板端/插座-闭口; Structure: 1x4P; Pitch: 3.81mm; Mounting Style: 直针; Number of Pins: 4P; Number of Rows: 1; Number of PINs Per Row: 4; Current Rating (Max): 8A; Voltage Rating (Max): 300V; Contact Material: 黄铜; Contact Plating: 锡; Operating Temperature Range: -40℃~+105℃
CN15 CN16 CN18 = WJ15EDGVC-3.81-3P: 连接器类型:板端/插座-闭口;固定方式:-;结构:1x3P;间距:3.81mm;颜色:-;安装方式:直针;排数:1;每排PIN数:3;额定电流:8A;额定电压:300V;线规 - AWG:-;线规 - 平方毫米:-;触头材质:黄铜;触头镀层:锡;工作温度范围:-40℃~+105℃;焊接温度(最大值):-;; LCSC Part Name: 1x3P 3.81mm 排数:1 每排P数:3; Supplier Part: C8389; Manufacturer: KANGNEX(康奈克斯电气); Supplier Footprint: 插件,P=3.81mm; JLCPCB Part Class: 扩展库; Datasheet: https://atta.szlcsc.com/upload/public/pdf/source/20191225/C8389_B21BE5A0E910B8F69CE6926ACBB2B491.pdf; Supplier: LCSC; Connector Type: 板端/插座-闭口; Structure: 1x3P; Pitch: 3.81mm; Mounting Style: 直针; Number of Pins: 3P; Number of Rows: 1; Number of PINs Per Row: 3; Current Rating (Max): 8A; Voltage Rating (Max): 300V; Contact Material: 黄铜; Contact Plating: 锡; Operating Temperature Range: -40℃~+105℃
H1-H5 H7-H10 H15 H16 H19-H25 H32-H35 = PZ254V-11-02P: 排数:单排;总PIN位数:2;间距:2.54mm;插针结构:1x2P;行距:-;安装类型:直插;圆针/方针:方针;额定电流:-;额定电压:-;配合针长度:6mm;塑高:2.5mm;端接针长度:3mm;触头材质:黄铜;触头镀层:-;工作温度范围:-40℃~+105℃;颜色:黑色;; LCSC Part Name: 2.54mm 1x2P 直插 方针; Supplier Part: C492401; Manufacturer: XFCN(兴飞); Supplier Footprint: 直插,P=2.54mm; JLCPCB Part Class: Extended Part; Datasheet: https://atta.szlcsc.com/upload/public/pdf/source/20200309/C492401_A812433581A9B211A7FFA413ADDFF0E5.pdf; Supplier: LCSC; Number of Rows: 单排; Number of Pins: 2; Pitch: 2.54mm; Pin Structure: 1x2P; Mounting Type: 直插; Circluar Pins/Square Pins: 方针; Length of Mating Pin: 6mm; Insulation Height: 2.5mm; Length of End Connection Pin: 3mm; Contact Material: 黄铜; Operating Temperature Range: -40℃~+105℃; Color: 黑色
H26-H31 = PZ254V-11-03P: 插针结构:1x3P;间距:2.54mm;行距:-;圆针/方针:方针;安装方式:直插;排数:单排;总PIN位数:3P;额定电流:3A;额定电压:250V;配合针长度:6mm;塑高:2.5mm;端接针长度:3mm;工作温度:-40℃~+105℃;颜色:黑色;; LCSC Part Name: 1x3P 间距:2.54mm 方针 直插; Supplier Part: C2937625; Manufacturer: XFCN(兴飞); Supplier Footprint: 插件,P=2.54mm; JLCPCB Part Class: 扩展库; Datasheet: https://atta.szlcsc.com/upload/public/pdf/source/20200309/C492402_8335C3D49C4E4C618838D59BB1D024C1.pdf; Supplier: LCSC; Pin Structure: 1x3P; Pitch: 2.54mm; Circluar Pins/Square Pins: 方针; Mounting Type: 直插; Number of Rows: 单排; Number of Pins: 3P; Current Rating: 3A; Voltage Rating (Max): 250V; Length of Mating Pin: 6mm; Insulation Height: 2.5mm; Length of End Connection Pin: 3mm; Operating Temperature: -40℃~+105℃; Color: 黑色
R46 R47 = 0603电阻
RF1 = 【直插】BWSMA-KE-Z001_C496549: 连接器类型:板端;接口类型:内孔;端口数量:1;接口直径:-;接口长度/高度:-;频率-最大值:-;射频系列:SMA;阻抗:50Ω;样式:正脚;触头材质:-;触头镀层:-;工作温度范围:-65℃~+165℃;焊接温度(最大值):-;; LCSC Part Name: 内孔 SMA 正脚; Supplier Part: C496549; Manufacturer: BAT WIRELESS(蝙蝠无线); Supplier Footprint: 插件; JLCPCB Part Class: 扩展库; Datasheet: https://atta.szlcsc.com/upload/public/pdf/source/20221228/40BF41E56A06003A0210E1785CA66EA6.pdf; Supplier: LCSC; Connector Type: 板端; Interface Type: 内孔; Number of Ports: 1; RF Series: SMA; Impedance: 50Ω; Style: 正脚; Operating Temperature Range: -65℃~+165℃
U24 U29-U32 U34 U36 U41 U43 U44 U64 = 【电赛】直插拔端子-2P-3.81mm
U57-U59 U61 = My_M3螺丝孔

## Nets
+1.25V_REF: C83.2 H4.2 U27.2(OUT) U32.1
+2.5V_REF: C78.2 H2.2 R41.1 RF1.5 U25.2(OUT) U30.1
+2.5V_REFA: C30.2 H1.2 Q1.2(E) U9.2(REF) U29.1
+3.3V_LDO: C42.1 C51.2 C77.2 C81.2 H7.1 H7.2 H9.1 H9.2 H32.1 H32.2 H34.1 H34.2 R35.1 R42.2 U12.1(OUT) U25.1(IN) U27.1(IN) U36.1
+3.3V_REF: C80.2 H3.2 U26.2(OUT) U31.1
+5V_LDO: C27.2 C40.2 C79.2 CN7.3 CN10.3 CN11.3 CN12.3 CN14.3 CN15.3 CN16.3 D28.1(A) H26.3 H27.3 H28.3 H29.3 H30.3 H31.3 Q1.3(C) R15.2 R44.2 U3.3(OUT) U12.5(EN) U12.8(IN) U26.1(IN) U28.5(V+) U47.1
+9V_DCDC: C25.2 C46.1 C85.2 CN18.1 D28.2(K) H20.1 H20.2 L12.2 NC.2 R2.2 R22.2 U3.1(VIN) U43.1 U51.1
+24V_DCDC: C7.1 C43.2 C45.1 C47.2 C49.1 C53.2 C73.1 D5.1 H16.1 H16.2 L10.1 R45.2 SW3.1 U13.7(VIN) U14.7(VIN) U21.4(VIN) U41.1 U64.1
+36V_DCDC: C60.2 C63.2 C76.1 D15.2(K) D18.2(K) D22.2(K) H24.1 H24.2 R36.2 R38.2 U4.3(IN) U45.1
-2.5V_REF: H5.2 R40.2 U28.1(OUT) U34.1
-5V_LDO: C15.2 CN7.2 CN10.2 CN11.2 CN12.2 CN14.2 CN15.1 CN16.1 D29.2(K) H26.1 H27.1 H28.1 H29.1 H30.1 H31.1 R43.1 U8.3(OUT) U28.2(V-) U53.2
-9V_DCDC: C29.2 C50.2 C84.1 CN18.3 D24.1(A) D29.1(A) H22.1 H22.2 NC3.1 R6.1 R25.1 U8.2(IN) U14.6(GND) U14.9(PAD) U44.1 U52.2
-36V_DCDC: C75.2 D17.1(A) H23.1 H23.2 R39.1
GND: C30.1 C77.1 C78.1 C79.1 C80.1 C81.1 C83.1 C88.1 H1.1 H2.1 H3.1 H4.1 H5.1 H35.1 H35.2 R46.1 R47.1 RF1.1 RF1.2 RF1.3 RF1.4 U9.3(ANODE) U25.3(GND) U26.3(GND) U27.3(GND) U28.3(IN+) U29.2 U30.2 U31.2 U32.2 U34.2 U57.1
PGND: 24V-IN2.2 24V-IN2.3 -.1(PAD) C7.2 C15.1 C25.1 C27.1 C29.1 C40.1 C41.1 C43.1 C45.2 C46.2 C47.1 C49.2 C50.1 C51.1 C53.1 C60.1 C63.1 C73.2 C75.1 C76.2 C84.2 C85.1 C86.1 C87.1 C88.2 CN7.1 CN7.4 CN10.1 CN10.4 CN11.1 CN11.4 CN12.1 CN12.4 CN14.1 CN14.4 CN15.2 CN16.2 CN18.2 D5.2 D16.2(K) D25.1(A) H8.1 H8.2 H10.1 H10.2 H15.1 H15.2 H19.1 H19.2 H21.1 H21.2 H25.1 H25.2 H26.2 H27.2 H28.2 H29.2 H30.2 H31.2 H33.1 H33.2 L11.2 LED1.1(-) LED2.2(+) LED3.2(A) LED8.1(-) LED9.2(+) LED10.1(-) LED11.2(+) LED12.1(-) LED13.1(-) NC1.1 NC2.2 Q2.1(G) R23.1 R24.2 R34.1 R37.1 R46.2 R47.2 RP1.1 U3.2(GND) U8.1(GND) U12.3(NC) U12.4(GND) U12.9(EP) U13.6(GND) U13.9(PAD) U21.1(GND) U22.1 U24.2 U36.2 U37.2 U38.2 U41.2 U43.2 U44.2 U45.2 U46.2 U47.2 U51.2 U52.1 U53.1 U58.1 U59.1 U61.1 U64.2
ADJ_LDO: C87.2 D21.2(K) D22.1(A) R3.2 R5.2 U4.2(OUT) U24.1 U46.1
$1N4188: R40.1 R41.2 U28.4(IN-)
$2N620: C86.2 D21.1(A) R5.1 RP1.2 RP1.3 U4.1(ADJ)
$3N6694: NC.1 NC1.2 R22.1 R23.2 U13.4(VSENSE)
$3N6699: C44.2 D25.2(K) L12.1 U13.8(PH)
$3N6711: C44.1 U13.1(BOOT)
$3N6713: NC2.1 NC3.2 R24.1 R25.2 U14.4(VSENSE)
$3N6717: C48.2 D24.2(K) L11.1 U14.8(PH)
$3N6729: C48.1 U14.1(BOOT)
$3N9511: 24V-IN2.1 Q2.3(S) SW3.3
$3N11385: C74.1 D15.1(A) D18.1(A) L10.2 U21.3(SW) U21.6(SW)
$3N11493: R36.1 R37.2 U21.5(FB)
$3N12168: C74.2 D16.1(A) D17.2(K)
$3N14235: U13.5(ENA) U37.1
$3N14616: U14.5(ENA) U38.1
$3N15475: U21.2(EN) U22.2
$4N2290: C41.2 U12.6(NR)
$4N2295: C42.2 R34.2 R35.2 U12.2(FB)
$6N513: LED3.1(C) R3.1
$6N518: LED1.2(+) R2.1
$6N519: LED2.1(-) R6.2
$6N528: LED8.2(+) R38.1
$6N530: LED9.1(-) R39.2
$6N823: LED10.2(+) R42.1
$6N825: LED11.1(-) R43.2
$6N831: LED12.2(+) R44.1
$6N984: LED13.2(+) R45.1
Net-(+-1): +.1(PAD) Q2.2(D) U62.1 U62.2
Net-(Q1-1): Q1.1(B) R15.1 U9.1(CATHODE)

Not connected (* = marked no-connect by the designer): SW3 2*; U12 7(NC)*; U13 2(NC)* 3(NC)*; U14 2(NC)* 3(NC)*; U23 1*; U54 1*; U56 1*

## Notes on the sheets
sheet 1
- @
sheet 2
- @
sheet 3
- PowerIn
- @
- @
- @
sheet 4
- @
sheet 5
- DCDC OUT
- LDO OUT
- REF OUT
sheet 6
- DCDC PG
- LDO PG
